# EasyEDA Pro project stm32带接收机（不想画了，但是有原理图）.epro

# Schematic Schematic2

## Sheets
1 P1: Board Name: Board2; Create Date: 2025-12-01; Page Name: P1; Project Name: 飞控; Schematic Name: Schematic2; Update Date: 2025-12-08; Company: 嘉立创EDA; Page Size: A4; Version: V1.0
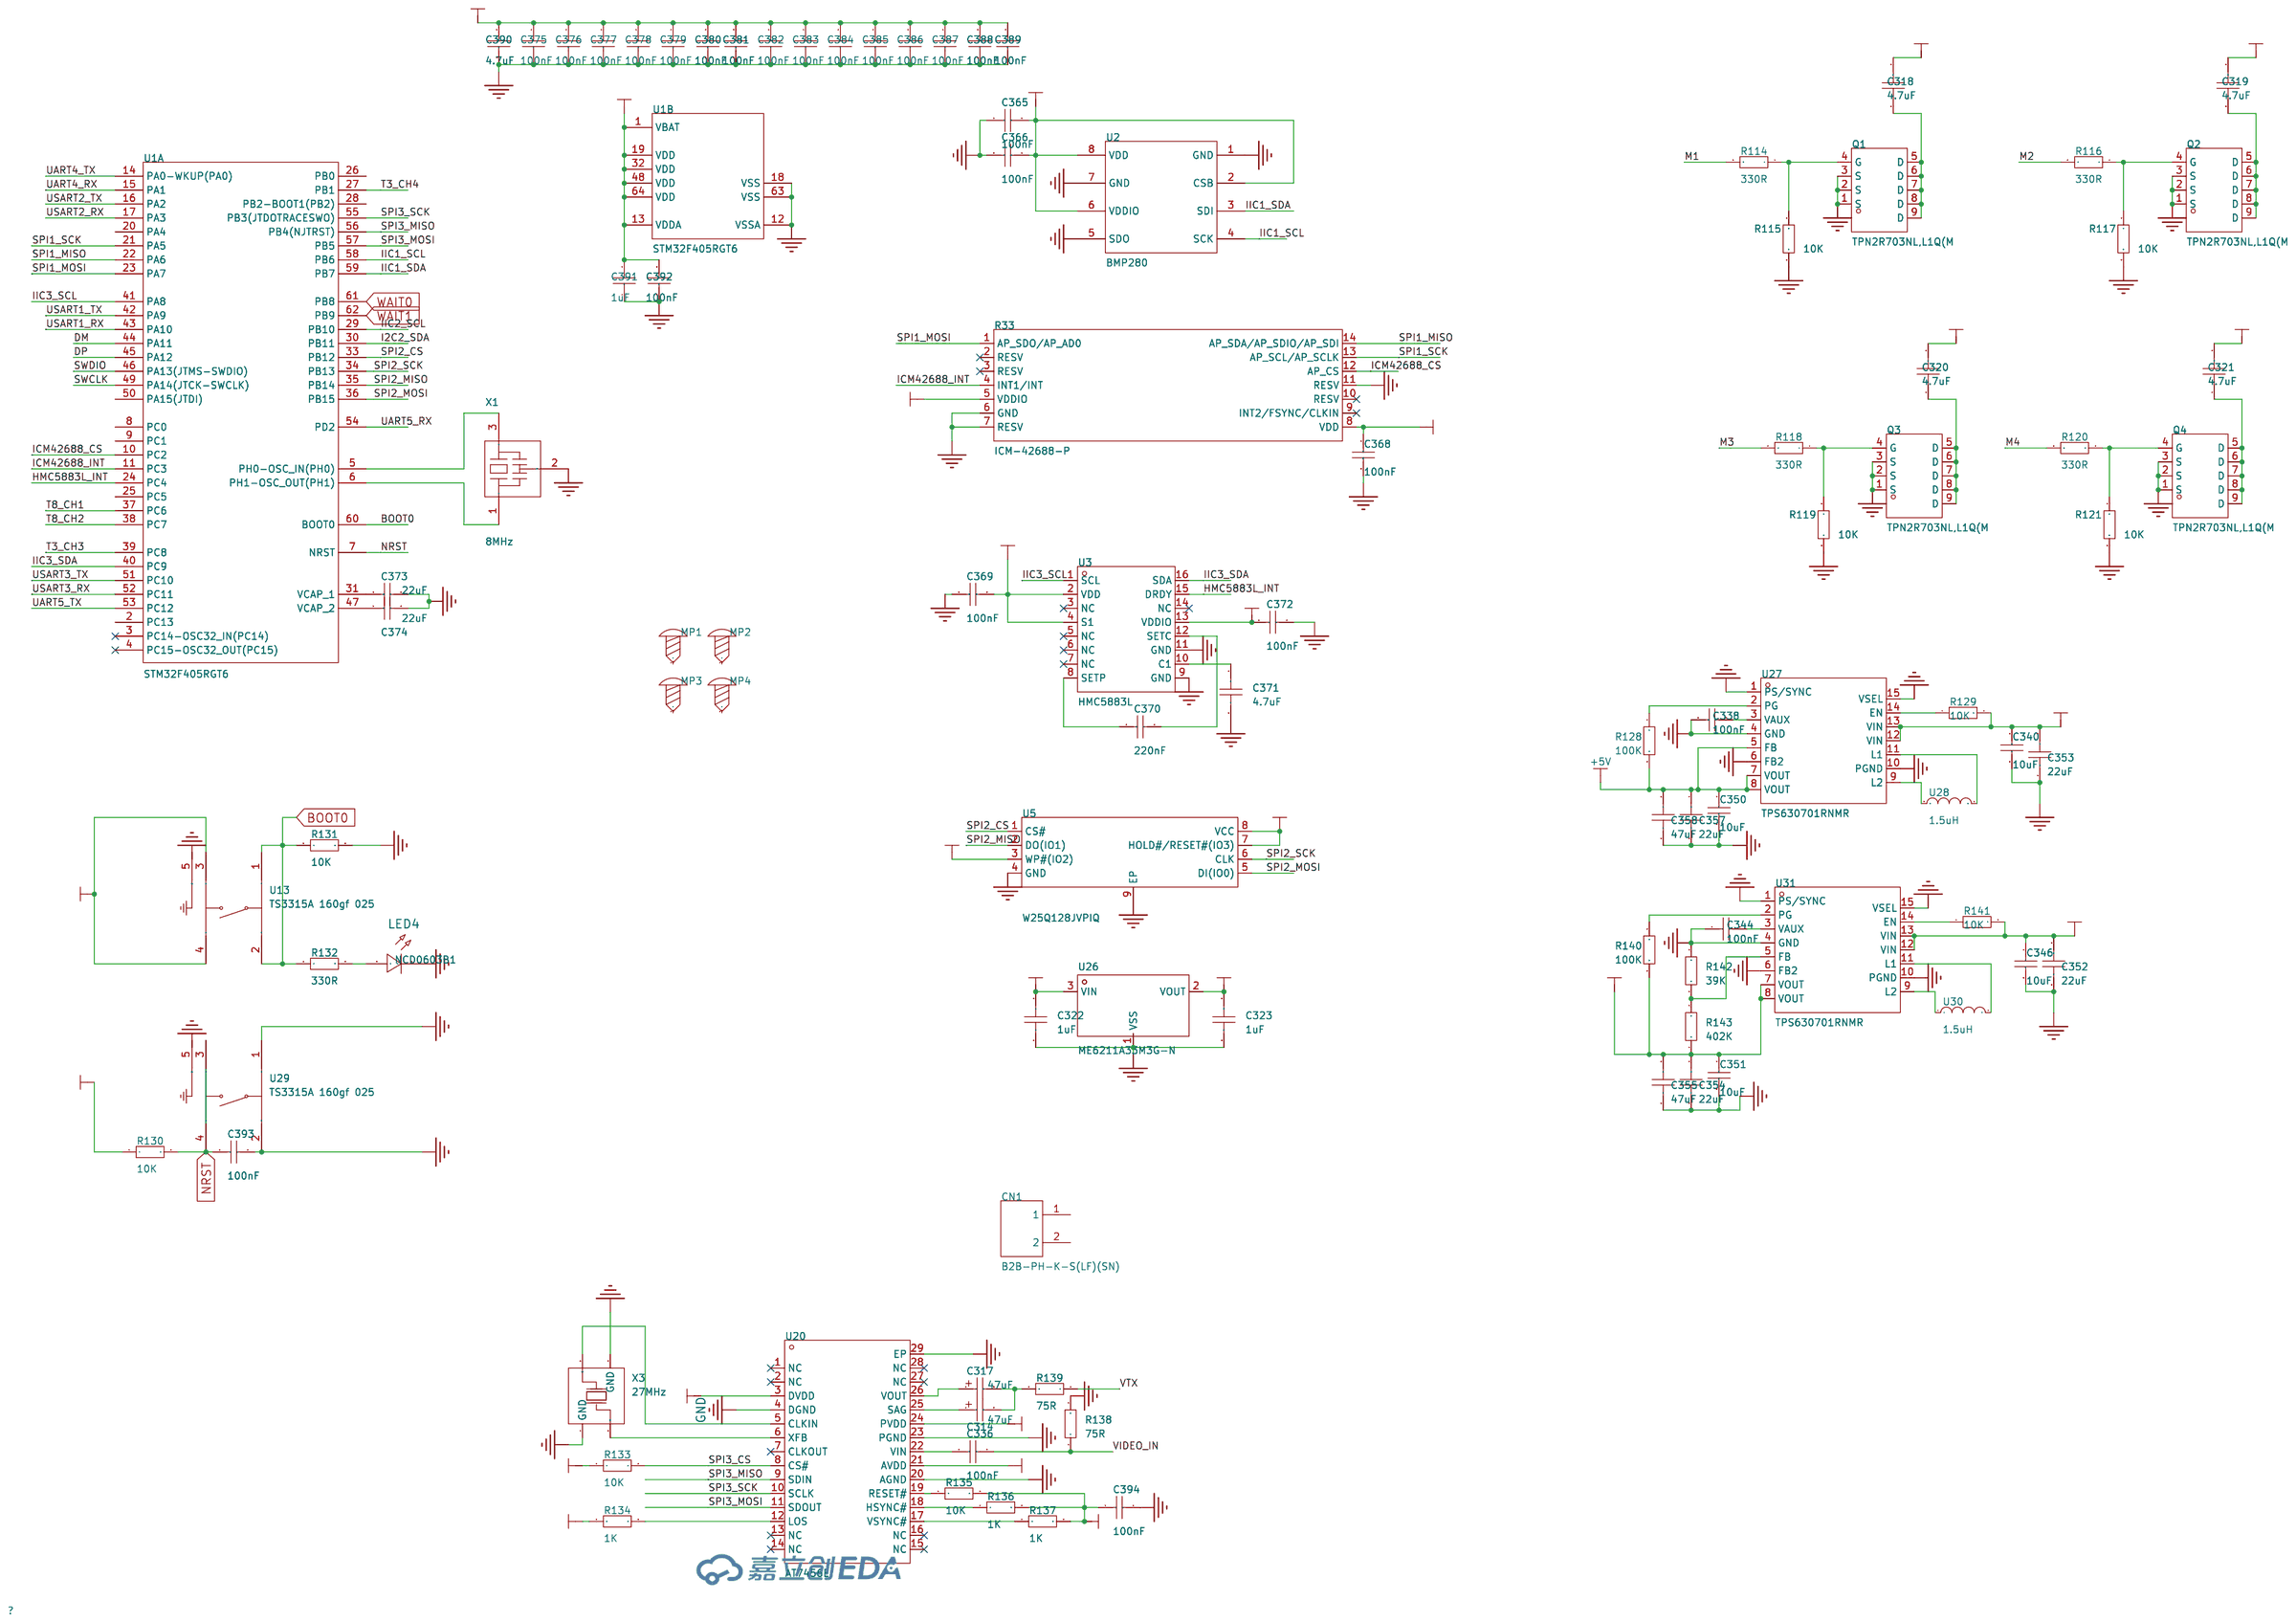
[diagram p0: P1]
2 P2: Create Date: 2025-12-08; Page Name: P2
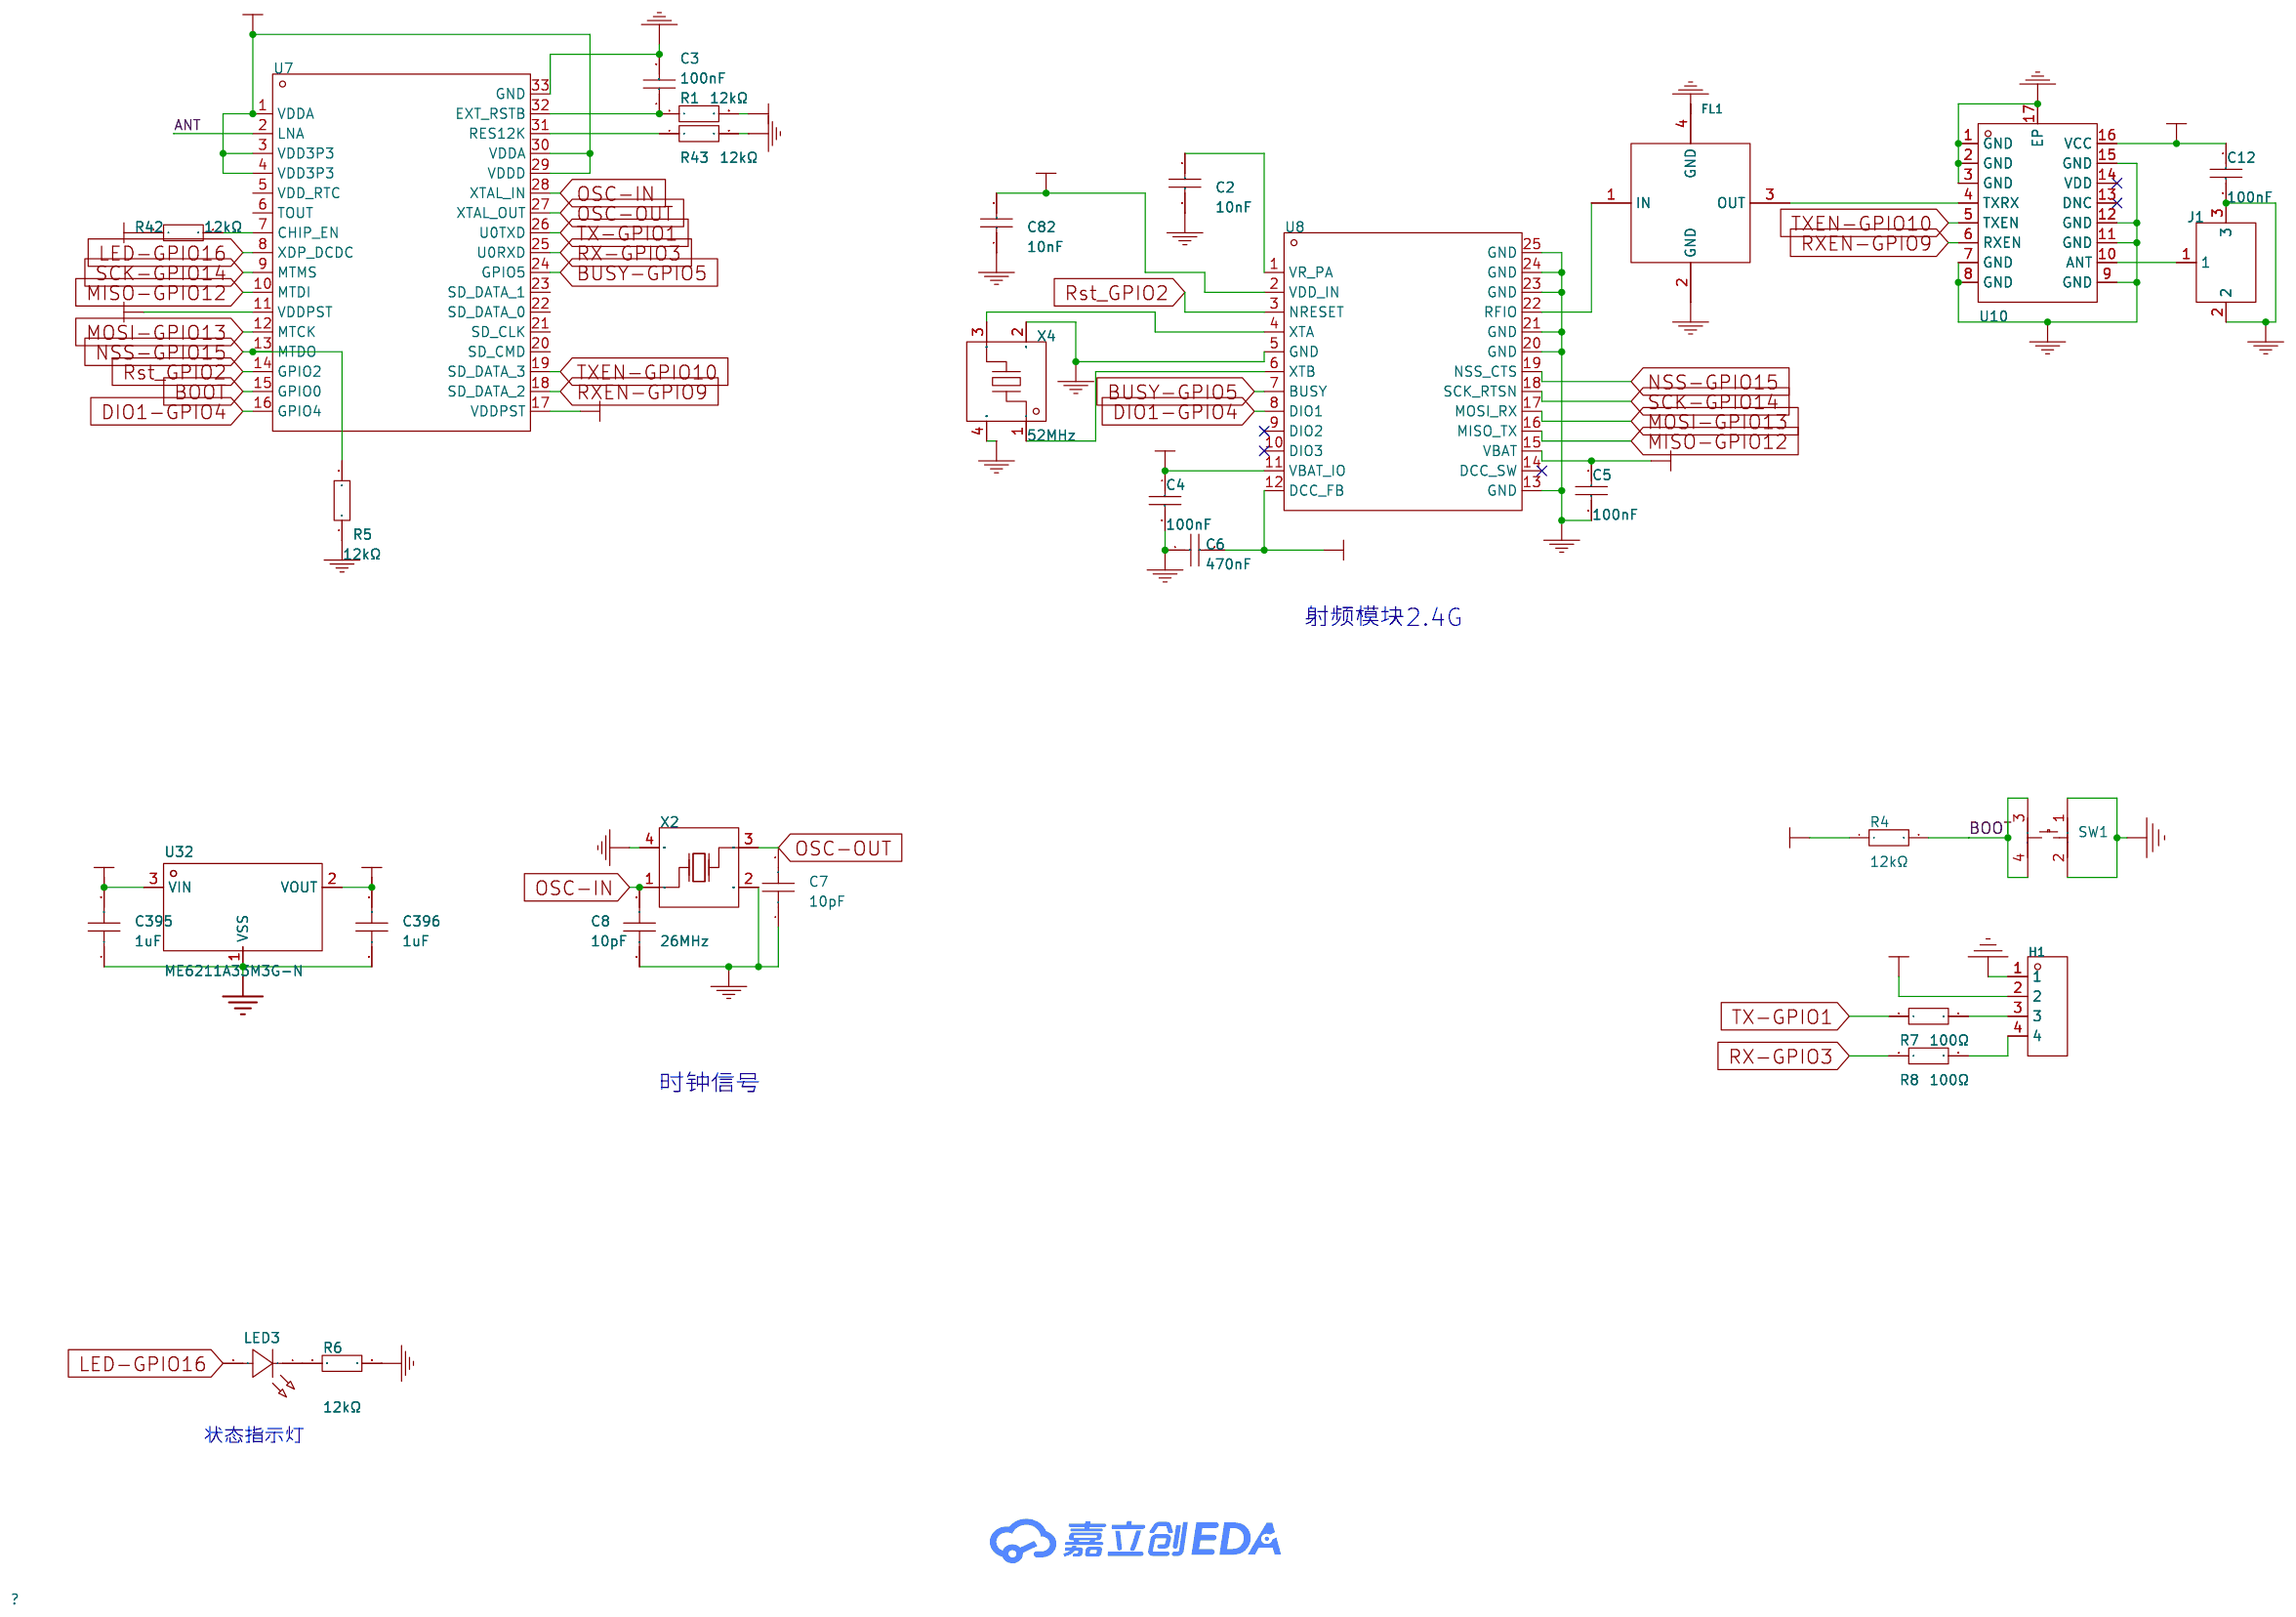
[diagram p1: P2]

## Parts
sheet P1
C314  47uF  [CAP-SMD_L3.2-W1.6-RD]
C317  47uF  [CAP-SMD_L3.2-W1.6-RD]
C318  4.7uF  [C0603]
C319  4.7uF  [C0603]
C320  4.7uF  [C0603]
C321  4.7uF  [C0603]
C322  1uF  [C0402]
C323  1uF  [C0402]
C336  100nF  [C0402]
C338  100nF  [C0402]
C340  10uF  [C0402]
C344  100nF  [C0402]
C346  10uF  [C0402]
C350  10uF  [C0402]
C351  10uF  [C0402]
C352  22uF  [C0805]
C353  22uF  [C0805]
C354  22uF  [C0805]
C355  47uF  [C0805]
C357  22uF  [C0805]
C358  47uF  [C0805]
C365  100nF  [C0402]
C366  100nF  [C0402]
C368  100nF  [C0402]
C369  100nF  [C0402]
C370  220nF  [C0402]
C371  4.7uF  [C0603]
C372  100nF  [C0402]
C373  22uF  [C0402]
C374  22uF  [C0402]
C375  100nF  [C0402]
C376  100nF  [C0402]
C377  100nF  [C0402]
C378  100nF  [C0402]
C379  100nF  [C0402]
C380  100nF  [C0402]
C381  100nF  [C0402]
C382  100nF  [C0402]
C383  100nF  [C0402]
C384  100nF  [C0402]
C385  100nF  [C0402]
C386  100nF  [C0402]
C387  100nF  [C0402]
C388  100nF  [C0402]
C389  100nF  [C0402]
C390  4.7uF  [C0402]
C391  1uF  [C0402]
C392  100nF  [C0402]
C393  100nF  [C0402]
C394  100nF  [C0402]
CN1  B2B-PH-K-S(LF)(SN)  [CONN-TH_B2B-PH-K-S]
LED4  NCD0603B1  [LED0603-RD]
MP1  M2螺丝  [M2螺丝]
MP2  M2螺丝  [M2螺丝]
MP3  M2螺丝  [M2螺丝]
MP4  M2螺丝  [M2螺丝]
Q1  TPN2R703NL,L1Q(M  [TSON-8_L3.1-W3.1-P0.65-LS3.3-BL-EP]
Q2  TPN2R703NL,L1Q(M  [TSON-8_L3.1-W3.1-P0.65-LS3.3-BL-EP]
Q3  TPN2R703NL,L1Q(M  [TSON-8_L3.1-W3.1-P0.65-LS3.3-BL-EP]
Q4  TPN2R703NL,L1Q(M  [TSON-8_L3.1-W3.1-P0.65-LS3.3-BL-EP]
R33  ICM-42688-P  [LGA-14_L3.0-W2.5-P0.50-TL]
R114  330R  [R0402]
R115  10K  [R0402]
R116  330R  [R0402]
R117  10K  [R0402]
R118  330R  [R0402]
R119  10K  [R0402]
R120  330R  [R0402]
R121  10K  [R0402]
R128  100K  [R0402]
R129  10K  [R0402]
R130  10K  [R0402]
R131  10K  [R0402]
R132  330R  [R0402]
R133  10K  [R0402]
R134  1K  [R0402]
R135  10K  [R0402]
R136  1K  [R0402]
R137  1K  [R0402]
R138  75R  [R0402]
R139  75R  [R0402]
R140  100K  [R0402]
R141  10K  [R0402]
R142  39K  [R0402]
R143  402K  [R0402]
U1  STM32F405RGT6  [LQFP-64_L10.0-W10.0-P0.50-LS12.0-BL]  (sections 1,2)
U2  BMP280  [LGA-8_L2.5-W2.0-P0.65_AMP6127]
U3  HMC5883L  [LPCC-16_L3.0-W3.0-P0.50-BL]
U5  W25Q128JVPIQ  [WSON-8_L5.0-W6.0-P1.27-BL-EP]
U13  TS3315A 160gf 025  [SW-SMD_4P-L3.4-W3.4-P2.00-LS4.0_TS3315A160GF]
U20  AT7456E  [TSSOP-28_L9.7-W4.4-P0.65-LS6.4-BL-EP-2]
U26  ME6211A33M3G-N  [SOT-23-3_L2.9-W1.6-P1.90-LS2.8-BR]
U27  TPS630701RNMR  [VQFN-HR-15_L3.0-W2.5-P0.50-BL_TPS63070RNMR]
U28  1.5uH  [IND-SMD_L2.5-W2.0_MEKK2520TR47M]
U29  TS3315A 160gf 025  [SW-SMD_4P-L3.4-W3.4-P2.00-LS4.0_TS3315A160GF]
U30  1.5uH  [IND-SMD_L2.5-W2.0_MEKK2520TR47M]
U31  TPS630701RNMR  [VQFN-HR-15_L3.0-W2.5-P0.50-BL_TPS63070RNMR]
X1  8MHz  [OSC-SMD_3P-L3.2-W1.3-P1.2-L]
X3  27MHz  [OSC-SMD_4P-L3.2-W2.5-BL]
sheet P2
C2  10nF  [C0402]
C3  100nF  [C0402]
C4  100nF  [C0402]
C5  100nF  [C0402]
C6  470nF  [C0402]
C7  10pF  [C0402]
C8  10pF  [C0402]
C12  100nF  [C0402]
C82  10nF  [C0402]
C395  1uF  [C0402]
C396  1uF  [C0402]
FL1  2450FM07D0034T  [FILTER-SMD_4P-L1.0-W0.5-L]
H1  PZ254V-11-04P  [HDR-TH_4P-P2.54-V-M]
J1  BWU.FL-IPEX1  [IPEX-SMD_BWIPX-1-001E]
LED3  XL-1005UGC  [0402]
R1  12kΩ  [0402]
R4  12kΩ  [0402]
R5  12kΩ  [0402]
R6  12kΩ  [0402]
R7  100Ω  [0402]
R8  100Ω  [0402]
R42  12kΩ  [0402]
R43  12kΩ  [0402]
SW1  TS-1928-B  [KEY-SMD_4P-L2.8-W2.0-P1.20-LS3.0-TL]
U7  ESP8285H16  [QFN-32_L5.0-W5.0-P0.50-TL-EP3.7]
U8  SX1280IMLTRT  [QFN-24_L4.0-W4.0-P0.50-BL-EP2.6]
U10  AT2401C  [QFN-16_L3.0-W3.0-P0.50-BL-EP1.7]
U32  ME6211A33M3G-N  [SOT-23-3_L2.9-W1.6-P1.90-LS2.8-BR]
X2  26MHz  [CRYSTAL-SMD_4P-L2.0-W1.6-BL]
X4  52MHz  [CRYSTAL-SMD_4P-L2.0-W1.6-BL]

## Library data of the parts
C314 C317 = TC212A476K006Y: 容值:47uF;精度:±10%;额定电压:6.3V;等效串联电阻:2.5Ω@100kHz;; LCSC Part Name: 47uF ±10% 6.3V; Supplier Part: C108525; Manufacturer: Sunlord(顺络); Supplier Footprint: CASE-A-3216-18(mm); JLCPCB Part Class: Extended Part; Datasheet: https://atta.szlcsc.com/upload/public/pdf/source/20231030/DDA5D10C6B7FCAF98AC7C23C2BD0B0CB.pdf; Supplier: LCSC; Tolerance: ±10%; Rated Voltage: 6.3V; Equivalent Series Resistance(ESR): 2.5Ω@100kHz; Operating Temperature: -55℃~+125℃; Voltage Rated: 6.3V; Temperature Coefficient: X5R
C318-C321 C371 = CAP_0603: Supplier Footprint: 0603
C7 C8 C322 C323 C395 C396 = CL05C100JB5NNNC: 容值:10pF;精度:±5%;额定电压:50V;材质(温度系数):C0G;; LCSC Part Name: 10pF ±5% 50V; Supplier Part: C32949; Manufacturer: SAMSUNG(三星); Supplier Footprint: 0402; JLCPCB Part Class: 基础库; Datasheet: https://atta.szlcsc.com/upload/public/pdf/source/20160103/1457707722238.pdf; Supplier: LCSC; Tolerance: ±5%; Voltage Rated: 50V; Temperature Coefficient: C0G
C3-C5 C12 C336 C338 C340 C344 C346 C350 C351 C365 C366 C368-C370 C372-C394 = CL05B104KO5NNNC: 容值:100nF;精度:±10%;额定电压:16V;材质(温度系数):X7R;; LCSC Part Name: 100nF ±10% 16V; Supplier Part: C1525; Manufacturer: SAMSUNG(三星); Supplier Footprint: 0402; JLCPCB Part Class: 基础库; Datasheet: https://atta.szlcsc.com/upload/public/pdf/source/20160103/1457707674891.pdf; Supplier: LCSC; Tolerance: ±10%; Voltage Rated: 16V; Temperature Coefficient: X7R
C352-C355 C357 C358 = CAP_0805: Supplier Footprint: 0805
CN1 = B2B-PH-K-S(LF)(SN): 插针结构:1x2P;间距:2mm;安装方式:直插;参考系列:PH;总PIN数:2P;排数:1;每排PIN数:2;行距:-;额定电流:2A;触头材质:黄铜;触头镀层:锡;工作温度:-25℃~+85℃;; LCSC Part Name: 1x2P 间距:2mm 直插 系列:PH; Supplier Part: C131337; Manufacturer: JST; Supplier Footprint: 插件,P=2mm; JLCPCB Part Class: 扩展库; Datasheet: https://item.szlcsc.com/datasheet/B2B-PH-K-S(LF)(SN)/142630.html; Supplier: LCSC; Pins Structure: 1x2P; Pitch: 2mm; Mounting Type: 直插; Reference Series: PH; Number of Pins: 2P; Number of Rows: 1; Number of PINs Per Row: 2; Current Rating: 2A; Contact Material: 黄铜; Contact Plating: 锡; Operating Temperature: -25℃~+85℃; Voltage Rating: 100V; Plastic Material: PA66; Flame Retardant Rating: UL94V-0; Supplementary Features: 打K脚; Color: 白色; Z-Height of the Board: 6mm; X-Length of Bottom Edge on Board (Spacing Line): 5.9mm; Y-Width of Bottom Edge on Board: 4.5mm
LED4 = NCD0603B1: 发光颜色:蓝色;功率:72mW;透镜颜色:无色透明;主波长:463nm~475nm;发光强度:80mcd~220mcd;发光角度:130°;工作温度:-30℃~+85℃;; LCSC Part Name: 蓝灯 0603蓝灯   正贴; Supplier Part: C84266; Manufacturer: 国星光电; Supplier Footprint: 0603; JLCPCB Part Class: Extended Part; Datasheet: https://atta.szlcsc.com/upload/public/pdf/source/20200820/C84266_6A3CDBEFA72C6CAD68EDA53474ADAE6C.pdf; Supplier: LCSC; Emitted Color: 蓝色; Forward Voltage (VF): 2.6V~3.6V; Forward Current: 10mA; Power Dissipation: 72mW; Lens Color: 无色透明; Dominant Wavelength: 463nm~475nm; Luminous Intensity: 80mcd~220mcd; Viewing Angle: 130°; Operating Temperature: -30℃~+85℃
MP1-MP4 = 螺丝孔
Q1-Q4 = TPN2R703NL,L1Q(M: 类型:1个N沟道;漏源电压(Vdss):30V;连续漏极电流(Id):-;导通电阻(RDS(on)@Vgs,Id):3.3mΩ@4.5V,22.5A;功率:42W;阈值电压(Vgs(th)@Id):1.3V@0.3mA;; Supplier Part: C5307666; Manufacturer: TOSHIBA(东芝); Supplier Footprint: TSON-8; JLCPCB Part Class: 扩展库; Datasheet: https://atta.szlcsc.com/upload/public/pdf/source/20221207/F3F28B90115C5E074AC0CD2ED28456D7.pdf; Supplier: LCSC; Type: 1个N沟道; Drain Source Voltage (Vdss): 30V; Drain Source On Resistance (RDS(on)@Vgs,Id): 3.3mΩ@4.5V,22.5A; Power Dissipation (Pd): 42W; Gate Threshold Voltage (Vgs(th)@Id): 1.3V@0.3mA; Input Capacitance (Ciss@Vds): 1.6nF@15V; Reverse Transfer Capacitance (Crss@Vds): 53pF@15V
R33 = ICM-42688-P: LCSC Part Name: ICM 42688 P; Supplier Part: C1850418; Manufacturer: TDK InvenSense(应美盛); Supplier Footprint: LGA-14(2.5x3); JLCPCB Part Class: 扩展库; Datasheet: https://atta.szlcsc.com/upload/public/pdf/source/20210703/CF24204867ACE5B754A2B035F23E5931.pdf; Supplier: LCSC
R114-R121 R128-R143 = Res_0402: Supplier Footprint: 0402
U1 = STM32F405RGT6: CPU内核:ARM-M4;CPU最大主频:168MHz;应用领域:-;; LCSC Part Name: 带DSP和FPU的高性能基础系列ARM Cortex-M4 MCU，具有1 MB Flash、168 MHz CPU和ART加速器; Supplier Part: C15742; Manufacturer: ST(意法半导体); Supplier Footprint: LQFP-64(10x10); JLCPCB Part Class: 扩展库; Datasheet: https://item.szlcsc.com/datasheet/STM32F405RGT6/16424.html; Supplier: LCSC; CPU Core: ARM-M4; CPU Maximum Speed: 168MHz; Program Storage Size: 1MB; Program Memory Type: FLASH; Number of I/O: 51; ADC (Bit): 12bit; DAC (Bit): 12bit; Voltage - Supply: 1.8V~3.6V
U2 = BMP280: Bosch气压传感器新品，可测量大气压力，带高精度温度测量，可校准精确计算海拔高度。I2C或SPI接口，宽量程（300-1100hpa），精度高; LCSC Part Name: BMP280 停产; Supplier Part: C83291; Manufacturer: Bosch(博世); Supplier Footprint: LGA-8(2x2.5); JLCPCB Part Class: 扩展库; Datasheet: https://atta.szlcsc.com/upload/public/pdf/source/20200702/C83291_F39E84AB7DFC569A4C7554F8659640A1.pdf; Supplier: LCSC
U3 = HMC5883L: Supplier Part: C2859540; Supplier Footprint: LPCC-16(3x3); JLCPCB Part Class: 扩展库; Supplier: LCSC
U5 = W25Q128JVPIQ: 接口类型:SPI;存储容量:128Mbit;时钟频率(fc):133MHz;; LCSC Part Name: 支持双路/四路SPI接口的3V、128Mbit 串行闪存; Supplier Part: C2803379; Manufacturer: Winbond(华邦); Supplier Footprint: WSON-8-EP(5x6); JLCPCB Part Class: 扩展库; Datasheet: https://item.szlcsc.com/datasheet/W25Q128JVPIQ/2946213.html; Supplier: LCSC; Interface: SPI; Memory Size: 128Mbit; Clock Frequency: 133MHz; Voltage - Supply: 2.7V~3.6V; Program / Erase Cycles: 100000次; Page Programming Time (Tpp): 400us; Block Erase Time(tBE): 120ms@(32KB); Data Retention - TDR (Year): 20年; Operating Temperature: -40℃~+85℃
U13 U29 = TS3315A 160gf 025: 触点电流：50mA 额定电压(DC)：12V 电路结构：单刀单掷 安装方式：立贴 按钮形状：圆形按钮 作用力：160gf±30gf 机械寿命：100000 工作温度：-30℃~+80℃ 开关长度：3.3mm 开关宽度：3.3mm 开关高度：1.5mm; LCSC Part Name: 3*3*1.5mm 四脚贴片 160gf不锈钢; Supplier Part: C5373425; Manufacturer: SHOU HAN(首韩); Supplier Footprint: SMD; Datasheet: https://atta.szlcsc.com/upload/public/pdf/source/20230321/D88CDF2C2FC55C1F5AF306EDD5E838E4.pdf; Supplier: LCSC
U20 = AT7456E: 视频字符叠加芯片，跟MAX7456-pin-pin; Supplier Part: C82351; Manufacturer: 杭州中科微; Supplier Footprint: TSSOP-28; JLCPCB Part Class: Extended Part; Datasheet: https://atta.szlcsc.com/upload/public/pdf/source/20180326/C82351_A40539A53E8345C88178541014FDE5FB.pdf; Supplier: LCSC
U26 U32 = ME6211A33M3G-N: 输出类型:固定;工作电压:6V;输出电压:3.3V;输出电流:500mA;电源纹波抑制比(PSRR):70dB@(1kHz);输出极性:正极;; LCSC Part Name: 输入6V 输出3.3V 500mA; Supplier Part: C168807; Manufacturer: MICRONE(南京微盟); Supplier Footprint: SOT-23-3; JLCPCB Part Class: 扩展库; Datasheet: https://atta.szlcsc.com/upload/public/pdf/source/20180224/C168807_15194366627921363679.pdf; Supplier: LCSC; Output Type: 固定; Voltage - Supply: 6V; Output Voltage: 3.3V; Output Current: 500mA; Power Supply Rejection Ratio (PSRR): 70dB@(1kHz); Voltage Dropout: 120mV@(100mA); standby current: 60uA; Noise: 50uVrms; Features: 过流保护；带使能；短路保护; Operating Temperature: -40℃~+150℃; Output Configuration: 正极; Number of Outputs: 1
U27 U31 = TPS630701RNMR: 功能类型:升降压型;工作电压:2V~16V;输出电压:5V;输出电流:2A;输出类型:固定;; LCSC Part Name: 2V 至 16V 3.6A 降压-升压转换器; Supplier Part: C2876599; Manufacturer: TI(德州仪器); Supplier Footprint: VQFN-15-HR(2.5x3); JLCPCB Part Class: 扩展库; Datasheet: https://www.ti.com/cn/lit/gpn/tps63070; Supplier: LCSC; Function: 升降压型; Voltage - Supply: 2V~16V; Output Voltage: 5V; Output Current: 2A; Frequency - Switching: 2.4MHz; Operating Temperature: -40℃~+125℃@(TJ); Synchronous Rectifier: 是; Number of Outputs: 1; Topology: 降压-升压式; Quiescent Current: 50uA; Switch tube (built-in/external): 内置; Output Type: 固定
U28 U30 = FTC252012S1R5MBCA: 电感值:1.5uH;精度:±20%;额定电流:3.7A;饱和电流(Isat):4.5A;类型:-;; LCSC Part Name: 1.5uH ±20% 4.5A; Supplier Part: C5832371; Manufacturer: cjiang(长江微电); Supplier Footprint: 1008; JLCPCB Part Class: 扩展库; Datasheet: https://item.szlcsc.com/datasheet/FTC252012S1R5MBCA/6763491.html; Supplier: LCSC; Tolerance: ±20%; Current Rating: 3.7A; Current - Saturation(Isat): 4.5A; DC Resistance(DCR): 44mΩ
X1 = CSTCE8M00G55-R0: 频率:8MHz;频率容差:±0.5%;内置负载电容:33pF;谐振阻抗:-;; LCSC Part Name: 8M ±0.5% 33pF 停产; Supplier Part: C70457; Manufacturer: muRata(村田); Supplier Footprint: SMD3213-3P; JLCPCB Part Class: 扩展库; Datasheet: https://atta.szlcsc.com/upload/public/pdf/source/20160405/1459820110299.pdf; Supplier: LCSC; Frequency Stability: ±0.2%; Frequency Tolerance: ±0.5%; Built-in Load Capacitance: 33pF; Operating Temperature: -20℃~+80℃
X3 = X1E000021015800: 频率:27MHz;晶振类型:贴片无源晶振;负载电容:10pF;等效串联电阻(ESR):40Ω;频率公差:±10ppm;频率稳定度:-;工作温度:-40℃~+85℃;; LCSC Part Name: TSX-3225 27MHz 10pF 10ppm; Supplier Part: C91748; Manufacturer: EPSON(爱普生); Supplier Footprint: SMD3225-4P; JLCPCB Part Class: Extended Part; Datasheet: https://atta.szlcsc.com/upload/public/pdf/source/20170103/1483439947812.pdf; Supplier: LCSC; Operating Temperature: -40℃~+85℃; Crystal Type: 贴片无源晶振; Load Capacitance: 10pF; Equivalent Series Resistance (ESR): 40Ω; Frequency Tolerance: ±10ppm
C2 C82 = CL05B103KB5NNNC: 容值:10nF;精度:±10%;额定电压:50V;材质(温度系数):X7R;; LCSC Part Name: 10nF ±10% 50V; Supplier Part: C15195; Manufacturer: SAMSUNG(三星); Supplier Footprint: 0402; JLCPCB Part Class: Basic Part; Datasheet: https://atta.szlcsc.com/upload/public/pdf/source/20160103/1457707674468.pdf; Supplier: LCSC; Tolerance: ±10%; Voltage Rated: 50V; Temperature Coefficient: X7R
C6 = CL05A474KP5NNNC: 容值:470nF;精度:±10%;额定电压:10V;材质(温度系数):X5R;; LCSC Part Name: 470nF ±10% 10V; Supplier Part: C47339; Manufacturer: SAMSUNG(三星); Supplier Footprint: 0402; JLCPCB Part Class: 基础库; Datasheet: https://atta.szlcsc.com/upload/public/pdf/source/20160103/1457707728896.pdf; Supplier: LCSC; Tolerance: ±10%; Voltage Rated: 10V; Temperature Coefficient: X5R
FL1 = 2450FM07D0034T: 带宽:100MHz;插入损耗:0.75dB;; Supplier Part: C2651081; Manufacturer: JOHANSON(约翰逊); Supplier Footprint: SMD-4P,0.5x1mm; JLCPCB Part Class: 扩展库; Datasheet: https://atta.szlcsc.com/upload/public/pdf/source/20210612/9CA01AE84E996BD7C4301146C7410C29.pdf; Supplier: LCSC; Bandwidth: 100MHz; Insertion Loss: 0.75dB
H1 = PZ254V-11-04P: 排数:单排;总PIN位数:4P;间距:2.54mm;插针结构:1x4P;行距:-;安装类型:直插;圆针/方针:方针;额定电流:3A;额定电压:250V;配合针长度:6mm;塑高:2.5mm;端接针长度:3mm;触头材质:-;工作温度范围:-40℃~+105℃;颜色:黑色;; LCSC Part Name: 2.54mm 1x4P 直插 方针; Supplier Part: C2691448; Manufacturer: XFCN(兴飞); Supplier Footprint: 插件,P=2.54mm; JLCPCB Part Class: 扩展库; Datasheet: https://atta.szlcsc.com/upload/public/pdf/source/20200309/C492403_F9F19131791D08044AD4F84F8E751A34.pdf; Supplier: LCSC; Number of Rows: 单排; Number of Pins: 4P; Pitch: 2.54mm; Pin Structure: 1x4P; Mounting Type: 直插; Circluar Pins/Square Pins: 方针; Current Rating (Max): 3A; Voltage Rating (Max): 250V; Length of Mating Pin: 6mm; Insulation Height: 2.5mm; Length of End Connection Pin: 3mm; Operating Temperature Range: -40℃~+105℃; Color: 黑色
J1 = BWU.FL-IPEX1: 连接器类型:板端;接口类型:内针;频率-最大值:6GHz;接口直径:2mm;射频系列:IPEX;端口数量:1;阻抗:50Ω;接口长度/高度:1.25mm;工作温度范围:260℃;; LCSC Part Name: IPEX 内针; Supplier Part: C5137195; Manufacturer: BAT WIRELESS(蝙蝠无线); Supplier Footprint: SMD; JLCPCB Part Class: 扩展库; Datasheet: https://atta.szlcsc.com/upload/public/pdf/source/20220815/058ABE525AAE400925F1A3839AB872AC.pdf; Supplier: LCSC; Connector Type: 板端; Interface Type: 内针; Frequency-Max: 6GHz; Interface Diameter: 2mm; RF Series: IPEX; Number of Ports: 1; Impedance: 50Ω; Interface Length/Height: 1.25mm; Operating Temperature Range: 260℃
LED3 = XL-1005UGC: 发光颜色:翠绿;主波长:516nm;色温:-;功率:80mW;安装方式:正贴;; LCSC Part Name: 正贴; Supplier Part: C2856703; Manufacturer: XINGLIGHT(成兴光); JLCPCB Part Class: 扩展库; Datasheet: https://atta.szlcsc.com/upload/public/pdf/source/20221102/FF8D6BC2225363A60A01D46BB802F217.pdf; Supplier: LCSC; Emitted Color: 翠绿; Lens Color: 无色透明; Dominant Wavelength: 516nm; Peak Wavelength: 531nm; Forward Current: 25mA; Power Dissipation: 80mW; Viewing Angle: 120°; Mounting Sytle: 正贴; Operating Temperature: -30℃~+85℃
R1 R4-R6 R42 R43 = 0402WGF1202TCE: 电阻类型:厚膜电阻;阻值:12kΩ;精度:±1%;功率:62.5mW;; LCSC Part Name: 12kΩ ±1% 62.5mW; Supplier Part: C25752; Manufacturer: UNI-ROYAL(厚声); JLCPCB Part Class: 基础库; Datasheet: https://atta.szlcsc.com/upload/public/pdf/source/20200306/C422600_1E6D84923E4A46A82E41ADD87F860B5C.pdf; Supplier: LCSC; Type: 厚膜电阻; Tolerance: ±1%; Power(Watts): 62.5mW; Temperature Coefficient: ±100ppm/℃; Overload Voltage (Max): 50V; Operating Temperature Range: -55℃~+155℃
R7 R8 = 0402WGF1000TCE: 阻值:100Ω;精度:±1%;功率:62.5mW;温度系数:±200ppm/℃;电阻类型:厚膜电阻;; LCSC Part Name: 100Ω ±1% 62.5mW 厚膜电阻; Supplier Part: C25076; Manufacturer: UNI-ROYAL(厚声); JLCPCB Part Class: 基础库; Datasheet: https://atta.szlcsc.com/upload/public/pdf/source/20200306/C422600_1E6D84923E4A46A82E41ADD87F860B5C.pdf; Supplier: LCSC; Tolerance: ±1%; Power(Watts): 62.5mW; Overload Voltage (Max): 50V; Temperature Coefficient: ±200ppm/℃; Type: 厚膜电阻; Operating Temperature Range: -55℃~+155℃
SW1 = TS-1928-B: 触点电流:50mA;额定电压(DC):12V;绝缘电阻:-;电路结构:单刀单掷;安装方式:立贴;带灯:无;作用力:160gf;机械寿命:30万次;带支架:否;; LCSC Part Name: 立贴 1.95*2.8*0.6mm 轻触开关; Supplier Part: C1121891; Manufacturer: XKB Connectivity(中国星坤); Supplier Footprint: SMD; JLCPCB Part Class: 扩展库; Datasheet: https://atta.szlcsc.com/upload/public/pdf/source/20211011/D4E0D57631292A8298BD84F341C06C74.pdf; Supplier: LCSC; Contact Current: 50mA; Voltage Rating (DC): 12V; Circuit: 单刀单掷; Mounting Style: 立贴; Actuator Style: 圆形按钮; Actuator/Cap Color: 黑色; With Lamp: 无; Operating Force: 160gf; Mechanical Life: 30万次; Operating Temperature: -30℃~+85℃; Switch Length: 1.95mm; Switch Width: 2.8mm; Switch Height: 0.6mm; Strike Gundam: 否
U7 = ESP8285H16: 接口类型:-;; Supplier Part: C967019; Manufacturer: ESPRESSIF(乐鑫); Supplier Footprint: QFN-32; JLCPCB Part Class: 扩展库; Datasheet: https://atta.szlcsc.com/upload/public/pdf/source/20201208/C967018_16BE38E2B139B5CC4A4A2601BD6D347C.pdf; Supplier: LCSC
U8 = SX1280IMLTRT: Supplier Part: C125969; Manufacturer: SEMTECH; Supplier Footprint: QFN-24-EP(4x4); JLCPCB Part Class: 扩展库; Datasheet: https://atta.szlcsc.com/upload/public/pdf/source/20180620/C125969_B671A7544015FF474F30CCF0F8154652.PDF; Supplier: LCSC
U10 = AT2401C: Supplier Part: C783588; Manufacturer: 杭州中科微; Supplier Footprint: QFN; JLCPCB Part Class: 扩展库; Datasheet: https://atta.szlcsc.com/upload/public/pdf/source/20210918/B63766BE646BC5750E173F3CF585A1F8.pdf; Supplier: LCSC
X2 = S2126000121080: 频率:26MHz;频率公差:±10ppm;负载电容:12pF;; LCSC Part Name: 26MHz ±10ppm 内置负载电容:12pF; Supplier Part: C390789; Manufacturer: JGHC(晶光华); Supplier Footprint: SMD2016-4P; JLCPCB Part Class: 扩展库; Datasheet: https://atta.szlcsc.com/upload/public/pdf/source/20191012/C390789_EEB0CA5BA4936358B143D734CA2B8FF9.pdf; Supplier: LCSC; Crystal Type: 贴片无源晶振; Frequency Tolerance: ±10ppm; Load Capacitance: 12pF; Equivalent Series Resistance (ESR): 80Ω; Operating Temperature: -40℃~+85℃
X4 = 7D052000K01: 频率:52MHz;频率公差:±10ppm;负载电容:11pF;; LCSC Part Name: 52MHz ±10ppm 11pF; Supplier Part: C781784; Manufacturer: HD(浩都频率); Supplier Footprint: SMD2016-4P; JLCPCB Part Class: 扩展库; Datasheet: https://atta.szlcsc.com/upload/public/pdf/source/20220223/F1A4CFB1E963BF2DCD368CB38C2B78AF.pdf; Supplier: LCSC; Crystal Type: 贴片无源晶振; Frequency Tolerance: ±10ppm; Frequency Stability: ±20ppm; Load Capacitance: 11pF

## Nets
3.3V: C4.1 C5.1 C12.1 C323.2 C396.2 R1.2 R4.1 R42.1 U7.1(VDDA) U7.3(VDD3P3) U7.4(VDD3P3) U7.11(VDDPST) U7.17(VDDPST) U7.29(VDDD) U7.30(VDDA) U8.11(VBAT_IO) U8.15(VBAT) U10.16(VCC) U26.2(VOUT) U32.2(VOUT)
3V3: C369.2 C372.1 C375.2 C376.2 C377.2 C378.2 C379.2 C380.2 C381.2 C382.2 C383.2 C384.2 C385.2 C386.2 C387.2 C388.2 C389.2 C390.2 C391.2 C392.2 U1.1(VBAT) U1.13(VDDA) U1.19(VDD) U1.32(VDD) U1.48(VDD) U1.64(VDD) U3.2(VDD) U3.4(S1) U3.13(VDDIO) U5.3(WP#(IO2)) U5.7(HOLD#/RESET#(IO3)) U5.8(VCC)
5V-IN: H1.2
+3.3V: C365.2 C366.2 C394.1 R133.1 R134.1 R135.2 R136.2 R137.2 U2.2(CSB) U2.6(VDDIO) U2.8(VDD) U20.3(DVDD) U20.21(AVDD) U20.24(PVDD)
+3.3V_MCU: C368.1 R33.5(VDDIO) R33.8(VDD) R130.1 U13.3(C) U13.4(D)
+5V: C322.2 C350.1 C357.2 C358.2 C395.2 R128.2 U26.3(VIN) U27.5(FB) U27.7(VOUT) U27.8(VOUT) U32.3(VIN)
+9V: C351.1 C354.2 C355.2 R140.2 R143.1 U31.7(VOUT) U31.8(VOUT)
+VBAT: C340.1 C346.1 C352.2 C353.2 R129.2 R141.2 U27.12(VIN) U27.13(VIN) U31.12(VIN) U31.13(VIN)
GND: C2.1 C3.2 C4.2 C5.2 C6.1 C7.1 C8.1 C12.2 C82.1 C322.1 C323.1 C338.1 C340.2 C344.1 C346.2 C350.2 C351.2 C352.1 C353.1 C354.1 C355.1 C357.1 C358.1 C365.1 C366.1 C368.2 C369.1 C371.2 C372.2 C373.2 C374.2 C375.1 C376.1 C377.1 C378.1 C379.1 C380.1 C381.1 C382.1 C383.1 C384.1 C385.1 C386.1 C387.1 C388.1 C389.1 C390.1 C391.1 C392.1 C393.1 C394.2 C395.1 C396.1 FL1.2(GND) FL1.4(GND) H1.1 J1.2 J1.3 LED4.1(C) Q1.1(S) Q1.2(S) Q1.3(S) Q2.1(S) Q2.2(S) Q2.3(S) Q3.1(S) Q3.2(S) Q3.3(S) Q4.1(S) Q4.2(S) Q4.3(S) R5.1 R6.2 R33.6(GND) R33.7(RESV) R33.11(RESV) R43.2 R115.2 R117.2 R119.2 R121.2 R131.2 R138.2 R142.2 SW1.1 SW1.2 U1.12(VSSA) U1.18(VSS) U1.63(VSS) U2.1(GND) U2.5(SDO) U2.7(GND) U3.9(GND) U3.11(GND) U5.4(GND) U5.9(EP) U7.33(GND) U8.5(GND) U8.13(GND) U8.20(GND) U8.21(GND) U8.23(GND) U8.24(GND) U8.25(GND) U10.1(GND) U10.2(GND) U10.3(GND) U10.7(GND) U10.8(GND) U10.9(GND) U10.11(GND) U10.12(GND) U10.15(GND) U10.17(EP) U13.5(GND) U20.4(DGND) U20.20(AGND) U20.23(PGND) U20.29(EP) U26.1(VSS) U27.1(PS/SYNC) U27.4(GND) U27.6(FB2) U27.10(PGND) U27.15(VSEL) U29.1(A) U29.2(B) U29.5(GND) U31.1(PS/SYNC) U31.4(GND) U31.6(FB2) U31.10(PGND) U31.15(VSEL) U32.1(VSS) X1.2(VSS) X2.2(GND) X2.4(GND) X3.2(GND) X3.4(GND) X4.2(GND) X4.4(GND)
VBAT: C318.2 C319.2 C320.2 C321.2
ANT: U7.2(LNA)
BOOT: R4.2 SW1.3 SW1.4 U7.15(GPIO0)
BOOT0: R131.1 R132.1 U1.60(BOOT0) U13.1(A) U13.2(B)
BUSY-GPIO5: U7.24(GPIO5) U8.7(BUSY)
DCC_FB: C6.2 C82.2 U8.2(VDD_IN) U8.12(DCC_FB)
DIO1-GPIO4: U7.16(GPIO4) U8.8(DIO1)
DM: U1.44(PA11)
DP: U1.45(PA12)
HMC5883L_INT: U1.24(PC4) U3.15(DRDY)
I2C2_SDA: U1.30(PB11)
ICM42688_CS: R33.12(AP_CS) U1.10(PC2)
ICM42688_INT: R33.4(INT1/INT) U1.11(PC3)
IIC1_SCL: U1.58(PB6) U2.4(SCK)
IIC1_SDA: U1.59(PB7) U2.3(SDI)
IIC2_SCL: U1.29(PB10)
IIC3_SCL: U1.41(PA8) U3.1(SCL)
IIC3_SDA: U1.40(PC9) U3.16(SDA)
LED-GPIO16: LED3.2(A) U7.8(XDP_DCDC)
M1: R114.2
M2: R116.2
M3: R118.2
M4: R120.2
MISO-GPIO12: U7.10(MTDI) U8.16(MISO_TX)
MOSI-GPIO13: U7.12(MTCK) U8.17(MOSI_RX)
NRST: C393.2 R130.2 U1.7(NRST) U29.3(C) U29.4(D)
NSS-GPIO15: R5.2 U7.13(MTDO) U8.19(NSS_CTS)
OSC-IN: C8.2 U7.28(XTAL_IN) X2.1(OSC1)
OSC-OUT: C7.2 U7.27(XTAL_OUT) X2.3(OSC2)
Rst_GPIO2: U7.14(GPIO2) U8.3(NRESET)
RX-GPIO3: R8.1 U7.25(U0RXD)
RXEN-GPIO9: U7.18(SD_DATA_2) U10.6(RXEN)
SCK-GPIO14: U7.9(MTMS) U8.18(SCK_RTSN)
SPI1_MISO: R33.14(AP_SDA/AP_SDIO/AP_SDI) U1.22(PA6)
SPI1_MOSI: R33.1(AP_SDO/AP_AD0) U1.23(PA7)
SPI1_SCK: R33.13(AP_SCL/AP_SCLK) U1.21(PA5)
SPI2_CS: U1.33(PB12) U5.1(CS#)
SPI2_MISO: U1.35(PB14) U5.2(DO(IO1))
SPI2_MOSI: U1.36(PB15) U5.5(DI(IO0))
SPI2_SCK: U1.34(PB13) U5.6(CLK)
SPI3_CS: R133.2 U20.8(CS#)
SPI3_MISO: U1.56(PB4(NJTRST)) U20.9(SDIN)
SPI3_MOSI: U1.57(PB5) U20.11(SDOUT)
SPI3_SCK: U1.55(PB3(JTDOTRACESWO)) U20.10(SCLK)
SWCLK: U1.49(PA14(JTCK-SWCLK))
SWDIO: U1.46(PA13(JTMS-SWDIO))
T3_CH3: U1.39(PC8)
T3_CH4: U1.27(PB1)
T8_CH1: U1.37(PC6)
T8_CH2: U1.38(PC7)
TX-GPIO1: R7.1 U7.26(U0TXD)
TXEN-GPIO10: U7.19(SD_DATA_3) U10.5(TXEN)
UART4_RX: U1.15(PA1)
UART4_TX: U1.14(PA0-WKUP(PA0))
UART5_RX: U1.54(PD2)
UART5_TX: U1.53(PC12)
USART1_RX: U1.43(PA10)
USART1_TX: U1.42(PA9)
USART2_RX: U1.17(PA3)
USART2_TX: U1.16(PA2)
USART3_RX: U1.52(PC11)
USART3_TX: U1.51(PC10)
VIDEO_IN: C336.2 R138.1
VTX: R139.1
WAIT0: U1.61(PB8)
WAIT1: U1.62(PB9)
$1N1197: Q1.4(G) R114.1 R115.1
$1N1198: C318.1 Q1.5(D) Q1.6(D) Q1.7(D) Q1.8(D) Q1.9(D)
$1N1204: Q2.4(G) R116.1 R117.1
$1N1205: C319.1 Q2.5(D) Q2.6(D) Q2.7(D) Q2.8(D) Q2.9(D)
$1N1211: Q3.4(G) R118.1 R119.1
$1N1212: C320.1 Q3.5(D) Q3.6(D) Q3.7(D) Q3.8(D) Q3.9(D)
$1N1218: Q4.4(G) R120.1 R121.1
$1N1219: C321.1 Q4.5(D) Q4.6(D) Q4.7(D) Q4.8(D) Q4.9(D)
$1N2774: C370.1 U3.8(SETP)
$1N2779: C370.2 U3.12(SETC)
$1N2807: C371.1 U3.10(C1)
$1N4326: U1.5(PH0-OSC_IN(PH0)) X1.3
$1N4335: U1.6(PH1-OSC_OUT(PH1)) X1.1
$1N4576: LED4.2(A) R132.2
$1N6614: C338.2 U27.3(VAUX)
$1N6616: R128.1 U27.2(PG)
$1N6619: R129.1 U27.14(EN)
$1N6622: U27.9(L2) U28.1
$1N6623: U27.11(L1) U28.2
$1N8521: C373.1 U1.31(VCAP_1)
$1N8557: C374.1 U1.47(VCAP_2)
$1N10992: U20.6(XFB) X3.1(OSC1)
$1N10993: U20.5(CLKIN) X3.3(OSC2)
$1N11005: R134.2 U20.12(LOS)
$1N11009: C336.1 U20.22(VIN)
$1N11012: R135.1 U20.19(RESET#)
$1N11013: R137.1 U20.17(VSYNC#)
$1N11014: R136.1 U20.18(HSYNC#)
$1N11017: C314.2 C317.2 R139.2
$1N11018: C317.1 U20.26(VOUT)
$1N11019: C314.1 U20.25(SAG)
$1N13942: C344.2 U31.3(VAUX)
$1N13944: R140.1 U31.2(PG)
$1N13946: R141.1 U31.14(EN)
$1N13949: U30.1 U31.9(L2)
$1N13950: U30.2 U31.11(L1)
$1N13954: R142.1 R143.2 U31.5(FB)
$2N2021: C3.1 R1.1 U7.32(EXT_RSTB)
$2N2023: R43.1 U7.31(RES12K)
$2N2025: R42.2 U7.7(CHIP_EN)
$2N2028: U8.4(XTA) X4.3(OUT)
$2N2031: U8.6(XTB) X4.1(IN)
$2N2036: C2.2 U8.1(VR_PA)
$2N2038: J1.1 U10.10(ANT)
$2N2039: FL1.1(IN) U8.22(RFIO)
$2N2049: LED3.1(K) R6.1
$2N2054: H1.4 R8.2
$2N2055: H1.3 R7.2
$2N2065: FL1.3(OUT) U10.4(TXRX)

Not connected (* = marked no-connect by the designer): CN1 1 2; MP1 1; MP2 1; MP3 1; MP4 1; R33 2(RESV)* 3(RESV)* 9(INT2/FSYNC/CLKIN)* 10(RESV)*; U1 2(PC13) 3(PC14-OSC32_IN(PC14))* 4(PC15-OSC32_OUT(PC15))* 8(PC0) 9(PC1) 20(PA4) 25(PC5) 26(PB0) 28(PB2-BOOT1(PB2)) 50(PA15(JTDI)); U3 3(NC)* 5(NC)* 6(NC)* 7(NC)* 14(NC)*; U7 5(VDD_RTC) 6(TOUT) 20(SD_CMD) 21(SD_CLK) 22(SD_DATA_0) 23(SD_DATA_1); U8 9(DIO2)* 10(DIO3)* 14(DCC_SW)*; U10 13(DNC)* 14(VDD)*; U20 1(NC)* 2(NC)* 7(CLKOUT)* 13(NC)* 14(NC)* 15(NC)* 16(NC)* 27(NC)* 28(NC)*

## Notes on the sheets
sheet 2
- 射频模块2.4G
- 时钟信号
- 状态指示灯

# Board PCB3
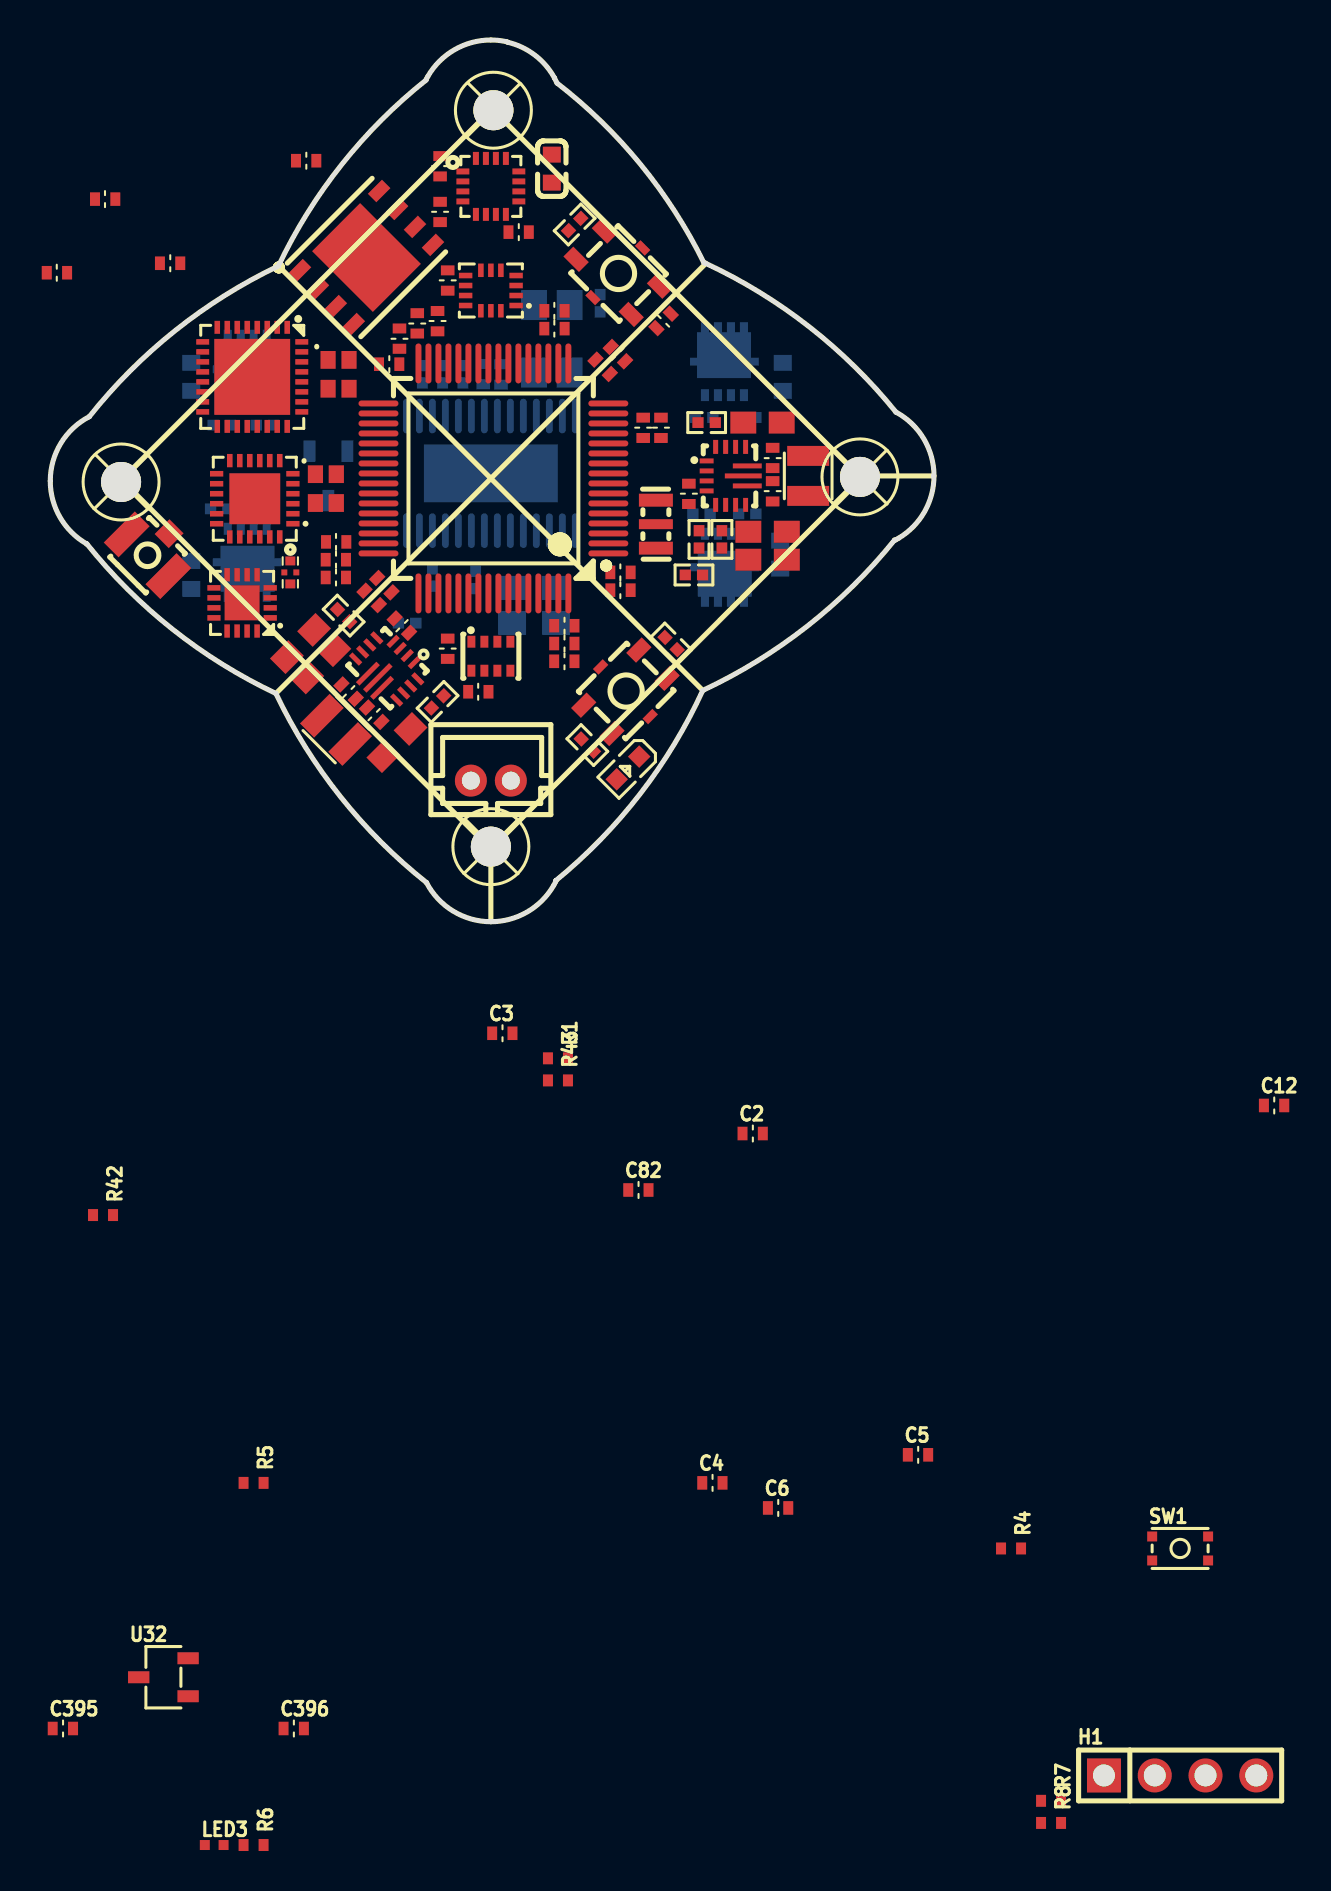
[diagram p2: board, top side]
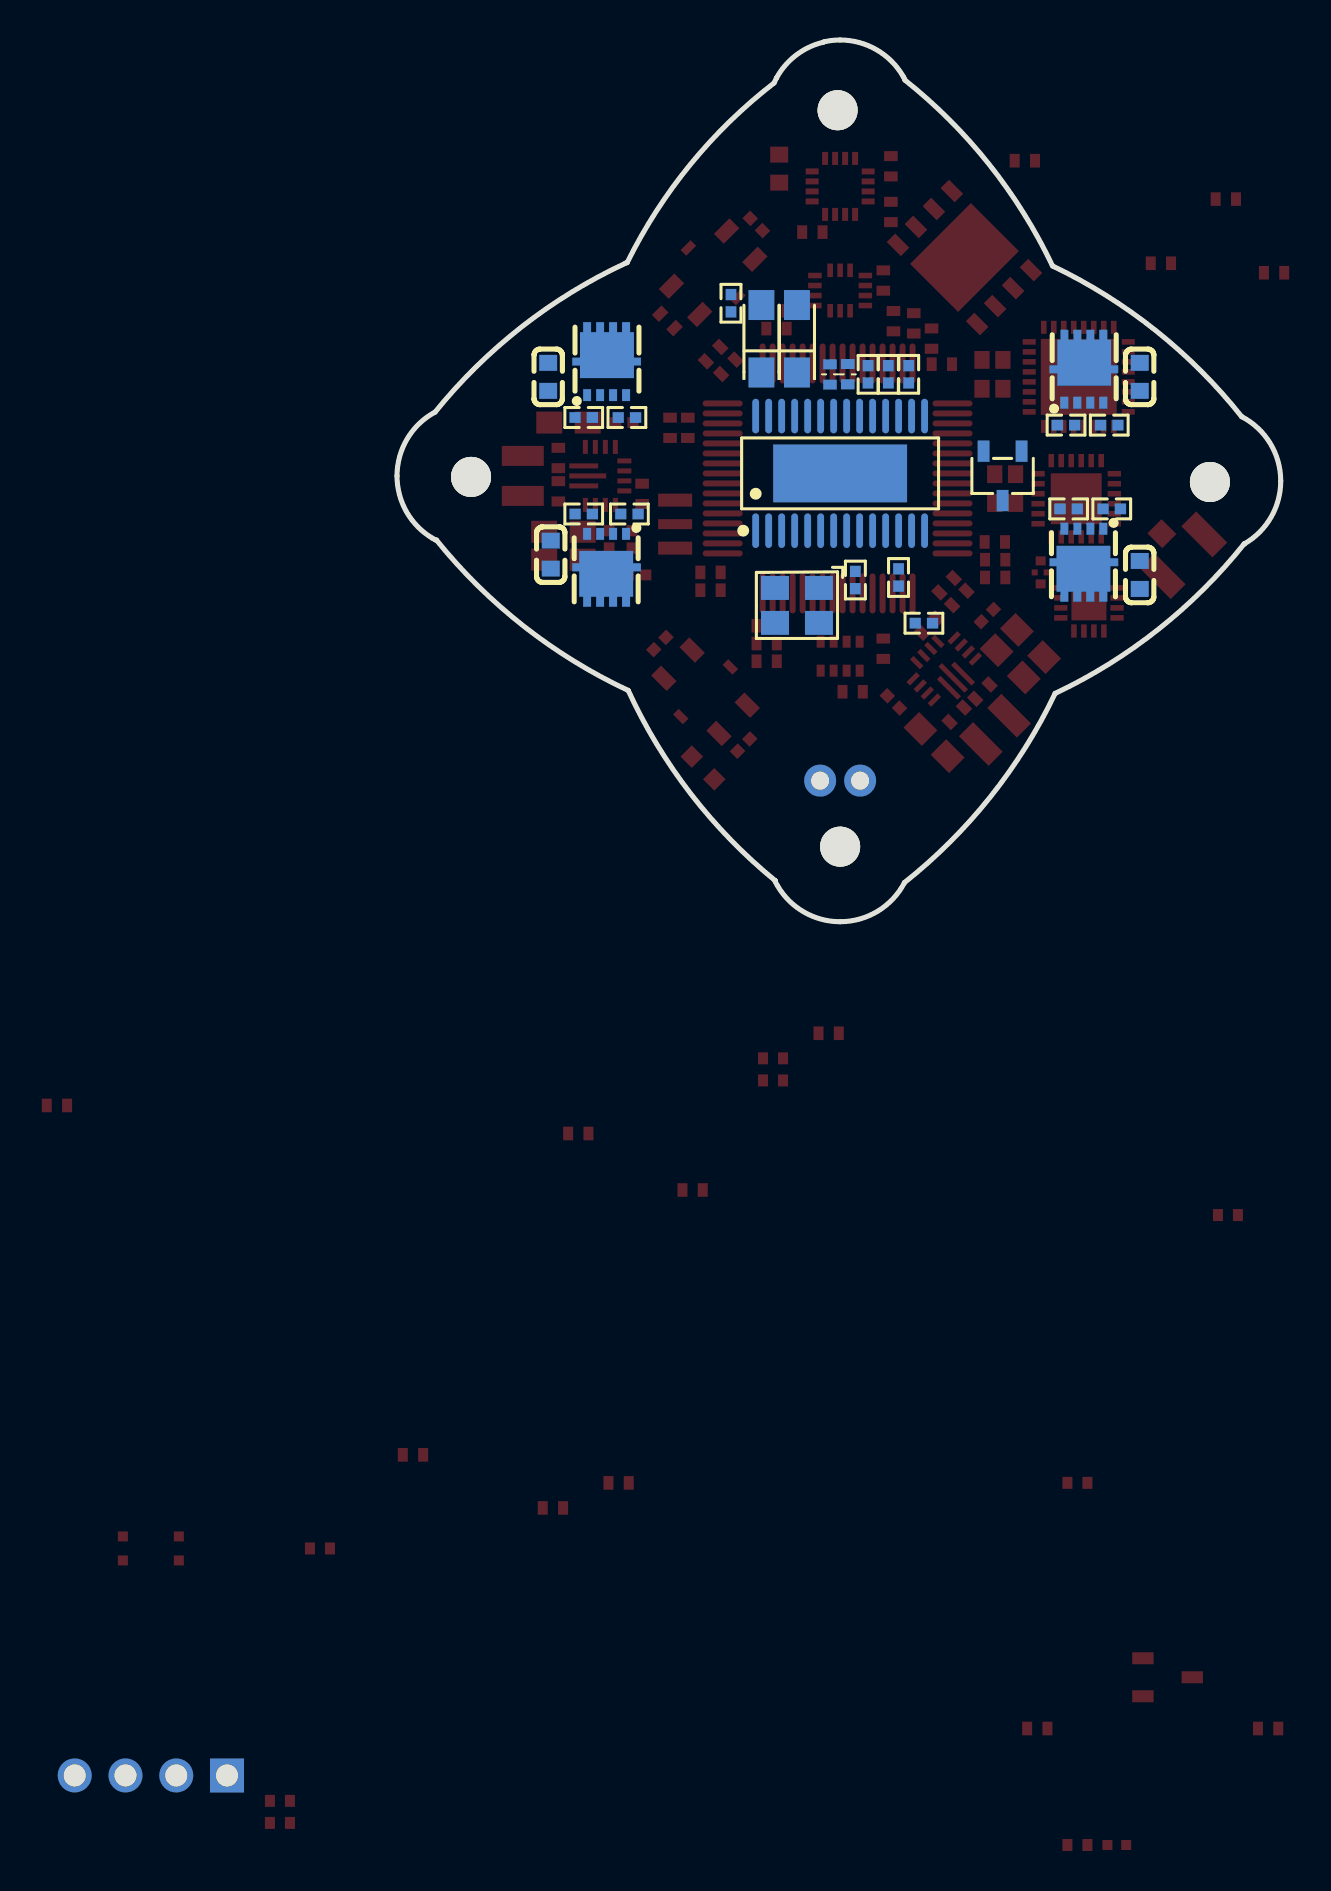
[diagram p3: board, bottom side, seen from below]

Outline 44.21 x 44.1 mm; copper layers: Top Layer, Bottom Layer. Coordinates in mm from the lower left corner of the outline.
Outline path: 0,22.04 arc(0.53,23.92) 1.95,25.26 arc(1.95,25.26) 1.95,25.26 arc(6.25,29.56) 11.4,32.79 arc(11.41,32.8) 11.42,32.81 arc(14.58,37.87) 18.8,42.09 arc(18.81,42.12) 18.82,42.14 arc(18.85,42.21) 18.89,42.27 arc(20.22,43.61) 22.04,44.1 arc(22.44,44.07) 22.83,44.01 arc(22.86,44) 22.88,43.98 arc(24.24,43.34) 25.22,42.2 arc(25.23,42.19) 25.23,42.19 arc(25.29,42.07) 25.35,41.94 arc(29.53,37.87) 32.7,32.96 arc(32.7,32.96) 32.71,32.96 arc(32.76,32.95) 32.81,32.92 arc(37.98,29.74) 42.3,25.49 arc(42.31,25.49) 42.31,25.48 arc(43.7,24.15) 44.21,22.3 arc(43.74,20.51) 42.45,19.19 arc(42.37,19.14) 42.3,19.1 arc(42.27,19.09) 42.24,19.08 arc(42.24,19.08) 42.23,19.08 arc(37.87,14.78) 32.66,11.57 arc(32.65,11.56) 32.64,11.56 arc(29.51,6.39) 25.3,2.06 25.3,2.06 arc(25.3,2.06) 25.3,2.06 arc(25.3,2.03) 25.29,2 arc(25.24,1.91) 25.19,1.82 arc(23.86,0.49) 22.04,0 arc(20.16,0.53) 18.82,1.95 arc(18.82,1.96) 18.82,1.96 arc(14.52,6.25) 11.3,11.4 arc(11.28,11.41) 11.27,11.42 arc(6.13,14.62) 1.84,18.89 arc(1.83,18.89) 1.82,18.9 arc(1.82,18.9) 1.81,18.9 arc(0.49,20.23) 0,22.04
Stack: Top Layer 0.035mm / Dielectric1 1.51mm FR4 er 4.5 / Bottom Layer 0.035mm

## Design rules (mm)
template: JLCPCB Capability(Two Layers Board)
spacing copperThickness1oz (default): track to track 0.102, other pairs 0.152 to 0.3
spacing copperThickness2oz: track to track 0.203, other pairs 0.152 to 0.3
track width copperThickness1oz (default): min 0.127, default 0.254, max 2.54
track width copperThickness2oz: min 0.203, default 0.254, max 2.54
differential pair differentialPair (default): width min 0.127, default 0.254, max 2.54; gap min 0.152, default 0.152
via viaSize (default): diameter min 0.5, default 0.61, max 10; hole min 0.3, default 0.305, max 6.3

## Placement (name value [footprint] x y rotation side)
C2  10nF  [C0402]  35.15 -10.59 0 top
C3  100nF  [C0402]  22.62 -5.58 0 top
C4  100nF  [C0402]  33.13 -28.06 0 top
C5  100nF  [C0402]  43.42 -26.66 0 top
C6  470nF  [C0402]  36.42 -29.32 0 top
C7  10pF  [C0402]  12.81 38.06 0 top
C8  10pF  [C0402]  6 32.93 0 top
C12  100nF  [C0402]  61.23 -9.19 0 top
C82  10nF  [C0402]  29.43 -13.42 0 top
C314  47uF  [CAP-SMD_L3.2-W1.6-RD]  24.2 29.15 90 bottom
C317  47uF  [CAP-SMD_L3.2-W1.6-RD]  25.98 29.15 90 bottom
C318  4.7uF  [C0603]  36.52 18.36 90 bottom
C319  4.7uF  [C0603]  7.06 17.34 270 bottom
C320  4.7uF  [C0603]  7.06 27.25 270 bottom
C321  4.7uF  [C0603]  36.65 27.25 270 bottom
C322  1uF  [C0402]  0.33 32.46 180 top
C323  1uF  [C0402]  2.74 36.14 180 top
C336  100nF  [C0402]  22.55 27.38 90 bottom
C338  100nF  [C0402]  17.6 14.8 315 top
C340  10uF  [C0402]  16.2 10.36 135 top
C344  100nF  [C0402]  31.95 21.41 90 top
C346  10uF  [C0402]  36.14 23.18 270 top
C350  10uF  [C0402]  14.93 11.5 315 top
C351  10uF  [C0402]  36.14 21.53 90 top
C352  22uF  [C0805]  35.63 24.96 180 top
C353  22uF  [C0805]  17.34 8.96 45 top
C354  22uF  [C0805]  35.89 19.5 180 top
C355  47uF  [C0805]  35.89 18.1 180 top
C357  22uF  [C0805]  13.53 12.9 45 top
C358  47uF  [C0805]  12.52 13.91 45 top
C365  100nF  [C0402]  21.41 11.5 180 top
C366  100nF  [C0402]  19.88 13.66 90 top
C368  100nF  [C0402]  19.88 32.07 90 top
C369  100nF  [C0402]  19.5 35.5 90 top
C370  220nF  [C0402]  23.44 34.49 0 top
C371  4.7uF  [C0603]  25.09 37.66 90 top
C372  100nF  [C0402]  19.5 37.79 90 top
C373  22uF  [C0402]  19.37 30.04 90 top
C374  22uF  [C0402]  14.3 18.99 180 top
C375  100nF  [C0402]  28.52 17.47 180 top
C376  100nF  [C0402]  18.36 29.92 270 top
C377  100nF  [C0402]  14.3 17.22 0 top
C378  100nF  [C0402]  28.52 16.58 180 top
C379  100nF  [C0402]  17.47 29.15 270 top
C380  100nF  [C0402]  14.3 18.1 0 top
C381  100nF  [C0402]  25.73 14.8 0 top
C382  100nF  [C0402]  25.22 30.55 180 top
C383  100nF  [C0402]  28.39 28.39 135 top
C384  100nF  [C0402]  25.73 13.91 0 top
C385  100nF  [C0402]  25.22 29.66 180 top
C386  100nF  [C0402]  16.71 16.83 135 top
C387  100nF  [C0402]  16.96 27.88 0 top
C388  100nF  [C0402]  25.73 13.02 0 top
C389  100nF  [C0402]  27.63 27.76 135 top
C390  4.7uF  [C0402]  16.07 16.2 135 top
C391  1uF  [C0402]  29.66 24.71 90 top
C392  100nF  [C0402]  30.55 24.71 90 top
C393  100nF  [C0402]  30.68 30.04 225 top
C394  100nF  [C0402]  21.66 27.38 270 bottom
C395  1uF  [C0402]  0.64 -40.35 0 top
C396  1uF  [C0402]  12.19 -40.35 0 top
CN1  B2B-PH-K-S(LF)(SN)  [CONN-TH_B2B-PH-K-S]  22.04 7.06 0 top
FL1  2450FM07D0034T  [FILTER-SMD_4P-L1.0-W0.5-L]  12.01 17.47 270 top
H1  PZ254V-11-04P  [HDR-TH_4P-P2.54-V-M]  56.52 -42.7 0 top
J1  BWU.FL-IPEX1  [IPEX-SMD_BWIPX-1-001E]  5.4 18.87 225 top
LED3  XL-1005UGC  [0402]  8.2 -46.17 0 top
LED4  NCD0603B1  [LED0603-RD]  28.9 7.69 225 top
MP1  -  [M2螺丝]  22.04 3.75 0 top
MP2  -  [M2螺丝]  22.17 40.58 0 top
MP3  -  [M2螺丝]  3.54 21.99 0 top
MP4  -  [M2螺丝]  40.51 22.25 0 top
Q1  TPN2R703NL,L1Q(M  [TSON-8_L3.1-W3.1-P0.65-LS3.3-BL-EP]  33.73 17.72 0 bottom
Q2  TPN2R703NL,L1Q(M  [TSON-8_L3.1-W3.1-P0.65-LS3.3-BL-EP]  9.85 17.98 0 bottom
Q3  TPN2R703NL,L1Q(M  [TSON-8_L3.1-W3.1-P0.65-LS3.3-BL-EP]  9.85 27.63 180 bottom
Q4  TPN2R703NL,L1Q(M  [TSON-8_L3.1-W3.1-P0.65-LS3.3-BL-EP]  33.73 28.01 180 bottom
R1  12kΩ  [0402#2]  25.4 -6.83 0 top
R4  12kΩ  [0402#2]  48.07 -31.34 0 top
R5  12kΩ  [0402#2]  10.17 -28.06 0 top
R6  12kΩ  [0402#2]  10.17 -46.17 0 top
R7  100Ω  [0402#2]  50.07 -43.97 0 top
R8  100Ω  [0402#2]  50.07 -45.07 0 top
R33  ICM-42688-P  [LGA-14_L3.0-W2.5-P0.50-TL]  22.04 31.57 180 top
R42  12kΩ  [0402#2]  2.64 -14.67 0 top
R43  12kΩ  [0402#2]  25.4 -7.94 0 top
R114  330R  [R0402]  32.58 20.39 180 bottom
R115  10K  [R0402]  34.87 20.39 0 bottom
R116  330R  [R0402]  10.61 20.64 0 bottom
R117  10K  [R0402]  8.45 20.64 180 bottom
R118  330R  [R0402]  10.74 24.84 0 bottom
R119  10K  [R0402]  8.58 24.84 180 bottom
R120  330R  [R0402]  32.71 25.22 180 bottom
R121  10K  [R0402]  34.87 25.22 0 bottom
R128  100K  [R0402]  14.68 15.31 135 top
R129  10K  [R0402]  19.37 10.99 225 top
R130  10K  [R0402]  26.23 34.87 225 top
R131  10K  [R0402]  31.06 13.91 315 top
R132  330R  [R0402]  26.87 8.83 315 top
R133  10K  [R0402]  21.28 17.09 90 bottom
R134  1K  [R0402]  19.12 17.22 90 bottom
R135  10K  [R0402]  20.64 27.38 90 bottom
R136  1K  [R0402]  19.63 27.38 90 bottom
R137  1K  [R0402]  18.61 27.38 90 bottom
R138  75R  [R0402]  17.85 14.93 180 bottom
R139  75R  [R0402]  27.5 30.93 270 bottom
R140  100K  [R0402]  32.2 17.34 0 top
R141  10K  [R0402]  32.84 24.96 0 top
R142  39K  [R0402]  33.6 19.12 90 top
R143  402K  [R0402]  32.46 19.12 90 top
SW1  TS-1928-B  [KEY-SMD_4P-L2.8-W2.0-P1.20-LS3.0-TL]  56.52 -31.34 0 top
U1  STM32F405RGT6  [LQFP-64_L10.0-W10.0-P0.50-LS12.0-BL]  22.17 22.17 90 top
U2  BMP280  [LGA-8_L2.5-W2.0-P0.65_AMP6127]  22.04 13.28 90 top
U3  HMC5883L  [LPCC-16_L3.0-W3.0-P0.50-BL]  22.04 36.77 270 top
U5  W25Q128JVPIQ  [WSON-8_L5.0-W6.0-P1.27-BL-EP]  15.82 33.22 315 top
U7  ESP8285H16  [QFN-32_L5.0-W5.0-P0.50-TL-EP3.7]  10.1 27.25 270 top
U8  SX1280IMLTRT  [QFN-24_L4.0-W4.0-P0.50-BL-EP2.6]  10.23 21.15 90 top
U10  AT2401C  [QFN-16_L3.0-W3.0-P0.50-BL-EP1.7]  9.6 15.95 90 top
U13  TS3315A 160gf 025  [SW-SMD_4P-L3.4-W3.4-P2.00-LS4.0_TS3315A160GF]  28.77 11.5 45 top
U20  AT7456E  [TSSOP-28_L9.7-W4.4-P0.65-LS6.4-BL-EP-2]  22.04 22.42 180 bottom
U26  ME6211A33M3G-N  [SOT-23-3_L2.9-W1.6-P1.90-LS2.8-BR]  13.91 22.3 90 bottom
U27  TPS630701RNMR  [VQFN-HR-15_L3.0-W2.5-P0.50-BL_TPS63070RNMR]  16.96 12.77 135 top
U28  1.5uH  [IND-SMD_L2.5-W2.0_MEKK2520TR47M]  14.3 9.6 135 top
U29  TS3315A 160gf 025  [SW-SMD_4P-L3.4-W3.4-P2.00-LS4.0_TS3315A160GF]  28.39 32.46 315 top
U30  1.5uH  [IND-SMD_L2.5-W2.0_MEKK2520TR47M]  37.92 22.3 270 top
U31  TPS630701RNMR  [VQFN-HR-15_L3.0-W2.5-P0.50-BL_TPS63070RNMR]  33.85 22.3 270 top
U32  ME6211A33M3G-N  [SOT-23-3_L2.9-W1.6-P1.90-LS2.8-BR]  5.66 -37.78 0 top
X1  8MHz  [OSC-SMD_3P-L3.2-W1.3-P1.2-L]  30.3 19.88 270 top
X2  26MHz  [CRYSTAL-SMD_4P-L2.0-W1.6-BL]  14.42 27.38 270 top
X3  27MHz  [OSC-SMD_4P-L3.2-W2.5-BL]  24.2 15.82 0 bottom
X4  52MHz  [CRYSTAL-SMD_4P-L2.0-W1.6-BL]  13.79 21.66 270 top

## Footprints (pads in the part's own frame, mm; a bottom-side part is the same pattern mirrored in y, then rotated)
0402
  rect 0.5x0.5 smd: 1(-0.47,0) 2(0.47,0)
0402#2
  rect 0.5x0.6 smd: 1(-0.5,0) 2(0.5,0)
C0402
  rect 0.5x0.68 smd: 1(-0.516,0) 2(0.5,0)
C0603
  rect 0.8x0.9 smd: 1(-0.7,0) 2(0.7,0)
C0805
  rect 1.3x1.1 smd: 1(-0.962,0) 2(0.962,0)
CAP-SMD_L3.2-W1.6-RD
  rect 1.5x1.296 smd: 1(-1.687,0) 2(1.687,0)
CONN-TH_B2B-PH-K-S
  round 1.6 hole 0.9: 1(1,0) 2(-1,0)
CRYSTAL-SMD_4P-L2.0-W1.6-BL
  rect 0.889x0.762 smd: 1(-0.722,-0.523) 2(0.722,-0.523) 3(0.722,0.523) 4(-0.722,0.523)
FILTER-SMD_4P-L1.0-W0.5-L
  rect 0.45x0.5 smd: 1(-0.575,0) 3(0.575,0)
  rect 0.3x0.3 smd: 2(0,-0.3) 4(0,0.3)
HDR-TH_4P-P2.54-V-M
  rect 1.7x1.7 hole 1.1: 1(-3.81,0)
  round 1.7 hole 1.1: 2(-1.27,0) 3(1.27,0) 4(3.81,0)
IND-SMD_L2.5-W2.0_MEKK2520TR47M
  rect 1x2.1 smd: 1(1,0) 2(-1,0)
IPEX-SMD_BWIPX-1-001E
  rect 1.05x1 smd: 1(-0.762,0)
  rect 2.2x1.05 smd: 2(0.762,-1.475) 3(0.762,1.475)
KEY-SMD_4P-L2.8-W2.0-P1.20-LS3.0-TL
  rect 0.5x0.5 smd: 1(-1.4,0.6) 2(1.4,0.6) 3(-1.4,-0.6) 4(1.4,-0.6)
LED0603-RD
  rect 0.8x0.8 smd: 1(-0.799,-0.004) 2(0.799,0.004)
LGA-8_L2.5-W2.0-P0.65_AMP6127
  rect 0.6x0.4 smd: 1(0.725,0.975) 2(0.725,0.325) 3(0.725,-0.325) 4(0.725,-0.975) 5(-0.725,-0.975) 6(-0.725,-0.325) 7(-0.725,0.325) 8(-0.725,0.975)
LGA-14_L3.0-W2.5-P0.50-TL
  rect 0.675x0.28 smd: 1(-1.262,0.75) 2(-1.262,0.25) 3(-1.262,-0.25) 4(-1.262,-0.75) 8(1.262,-0.75) 9(1.262,-0.25) 10(1.262,0.25) 11(1.262,0.75)
  rect 0.28x0.675 smd: 5(-0.5,-1.012) 6(0,-1.012) 7(0.5,-1.012) 12(0.5,1.012) 13(0,1.012) 14(-0.5,1.012)
LPCC-16_L3.0-W3.0-P0.50-BL
  rect 0.3x0.65 smd: 1(-0.749,-1.4) 2(-0.248,-1.4) 3(0.252,-1.4) 4(0.751,-1.4) 9(0.75,1.4) 10(0.25,1.4) 11(-0.25,1.4) 12(-0.75,1.4)
  rect 0.65x0.3 smd: 5(1.4,-0.748) 6(1.4,-0.248) 7(1.4,0.252) 8(1.4,0.752) 13(-1.4,0.752) 14(-1.4,0.252) 15(-1.4,-0.248) 16(-1.4,-0.748)
LQFP-64_L10.0-W10.0-P0.50-LS12.0-BL
  oval 0.3x2 smd: 1(-3.75,-5.75) 2(-3.25,-5.75) 3(-2.75,-5.75) 4(-2.25,-5.75) 5(-1.75,-5.75) 6(-1.25,-5.75) 7(-0.75,-5.75) 8(-0.25,-5.75) 9(0.25,-5.75) 10(0.75,-5.75) 11(1.25,-5.75) 12(1.75,-5.75) 13(2.25,-5.75) 14(2.75,-5.75) 15(3.25,-5.75) 16(3.75,-5.75) 33(3.75,5.75) 34(3.25,5.75) 35(2.75,5.75) 36(2.25,5.75) 37(1.75,5.75) 38(1.25,5.75) 39(0.75,5.75) 40(0.25,5.75) 41(-0.25,5.75) 42(-0.75,5.75) 43(-1.25,5.75) 44(-1.75,5.75) 45(-2.25,5.75) 46(-2.75,5.75) 47(-3.25,5.75) 48(-3.75,5.75)
  oval 2x0.3 smd: 17(5.75,-3.75) 18(5.75,-3.25) 19(5.75,-2.75) 20(5.75,-2.25) 21(5.75,-1.75) 22(5.75,-1.25) 23(5.75,-0.75) 24(5.75,-0.25) 25(5.75,0.25) 26(5.75,0.75) 27(5.75,1.25) 28(5.75,1.75) 29(5.75,2.25) 30(5.75,2.75) 31(5.75,3.25) 32(5.75,3.75) 49(-5.75,3.75) 50(-5.75,3.25) 51(-5.75,2.75) 52(-5.75,2.25) 53(-5.75,1.75) 54(-5.75,1.25) 55(-5.75,0.75) 56(-5.75,0.25) 57(-5.75,-0.25) 58(-5.75,-0.75) 59(-5.75,-1.25) 60(-5.75,-1.75) 61(-5.75,-2.25) 62(-5.75,-2.75) 63(-5.75,-3.25) 64(-5.75,-3.75)
M2螺丝
  round 2 hole 2: 1(0,0)
OSC-SMD_3P-L3.2-W1.3-P1.2-L
  rect 0.65x1.7 smd: 1(-1.2,0) 3(1.2,0)
  rect 0.5x1.7 smd: 2(0,0)
OSC-SMD_4P-L3.2-W2.5-BL
  rect 1.4x1.2 smd: 1(-1.1,-0.875) 2(1.1,-0.875) 3(1.1,0.875) 4(-1.1,0.875)
QFN-16_L3.0-W3.0-P0.50-BL-EP1.7
  rect 0.28x0.665 smd: 1(-0.75,-1.407) 2(-0.25,-1.407) 3(0.25,-1.407) 4(0.75,-1.407) 9(0.75,1.407) 10(0.25,1.407) 11(-0.25,1.407) 12(-0.75,1.407)
  rect 0.665x0.28 smd: 5(1.407,-0.75) 6(1.407,-0.25) 7(1.407,0.25) 8(1.407,0.75) 13(-1.407,0.75) 14(-1.407,0.25) 15(-1.407,-0.25) 16(-1.407,-0.75)
  rect 1.75x1.75 smd: 17(0,0)
QFN-24_L4.0-W4.0-P0.50-BL-EP2.6
  rect 0.28x0.665 smd: 1(-1.25,-1.907) 2(-0.75,-1.907) 3(-0.25,-1.907) 4(0.25,-1.907) 5(0.75,-1.907) 6(1.25,-1.907) 13(1.25,1.907) 14(0.75,1.907) 15(0.25,1.907) 16(-0.25,1.907) 17(-0.75,1.907) 18(-1.25,1.907)
  rect 0.665x0.28 smd: 7(1.907,-1.25) 8(1.907,-0.75) 9(1.907,-0.25) 10(1.907,0.25) 11(1.907,0.75) 12(1.907,1.25) 19(-1.907,1.25) 20(-1.907,0.75) 21(-1.907,0.25) 22(-1.907,-0.25) 23(-1.907,-0.75) 24(-1.907,-1.25)
  rect 2.55x2.55 smd: 25(0,0)
QFN-32_L5.0-W5.0-P0.50-TL-EP3.7
  rect 0.65x0.28 smd: 1(-2.478,1.75) 2(-2.478,1.25) 3(-2.478,0.75) 4(-2.478,0.25) 5(-2.478,-0.25) 6(-2.478,-0.75) 7(-2.478,-1.25) 8(-2.478,-1.75) 17(2.478,-1.75) 18(2.478,-1.25) 19(2.478,-0.75) 20(2.478,-0.25) 21(2.478,0.25) 22(2.478,0.75) 23(2.478,1.25) 24(2.478,1.75)
  rect 0.28x0.65 smd: 9(-1.75,-2.478) 10(-1.25,-2.478) 11(-0.75,-2.478) 12(-0.25,-2.478) 13(0.25,-2.478) 14(0.75,-2.478) 15(1.25,-2.478) 16(1.75,-2.478) 25(1.75,2.478) 26(1.25,2.478) 27(0.75,2.478) 28(0.25,2.478) 29(-0.25,2.478) 30(-0.75,2.478) 31(-1.25,2.478) 32(-1.75,2.478)
  rect 3.8x3.8 smd: 33(0,0)
R0402
  rect 0.566x0.54 smd: 1(-0.433,0) 2(0.433,0)
SOT-23-3_L2.9-W1.6-P1.90-LS2.8-BR
  rect 1.07x0.6 smd: 1(1.235,-0.95) 2(1.235,0.95) 3(-1.235,0)
SW-SMD_4P-L3.4-W3.4-P2.00-LS4.0_TS3315A160GF
  rect 1.1x0.7 smd: 1(-1.95,1) 2(1.95,1) 3(-1.95,-1) 4(1.95,-1)
  rect 0.7x0.4 smd: 5(0,1.755) 5(0,-1.755)
TSON-8_L3.1-W3.1-P0.65-LS3.3-BL-EP
  rect 0.4x0.6 smd: 1(-0.975,-1.675) 2(-0.325,-1.675) 3(0.325,-1.675) 4(0.975,-1.675) 5(0.975,1.675) 6(0.325,1.675) 7(-0.325,1.675) 8(-0.975,1.675)
  rect 0.6x0.4 smd: 9(-1.42,0) 9(1.42,0)
  rect 2.7x2.3 smd: 9(0.02,0.325)
TSSOP-28_L9.7-W4.4-P0.65-LS6.4-BL-EP-2
  oval 0.343x1.732 smd: 1(-4.225,-2.866) 2(-3.575,-2.866) 3(-2.925,-2.866) 4(-2.275,-2.866) 5(-1.625,-2.866) 6(-0.975,-2.866) 7(-0.325,-2.866) 8(0.325,-2.866) 9(0.975,-2.866) 10(1.625,-2.866) 11(2.275,-2.866) 12(2.925,-2.866) 13(3.575,-2.866) 14(4.225,-2.866) 15(4.225,2.866) 16(3.575,2.866) 17(2.925,2.866) 18(2.275,2.866) 19(1.625,2.866) 20(0.975,2.866) 21(0.325,2.866) 22(-0.325,2.866) 23(-0.975,2.866) 24(-1.625,2.866) 25(-2.275,2.866) 26(-2.925,2.866) 27(-3.575,2.866) 28(-4.225,2.866)
  rect 6.7x2.9 smd: 29(0,0)
VQFN-HR-15_L3.0-W2.5-P0.50-BL_TPS63070RNMR
  rect 0.25x0.7 smd: 1(-0.75,-1.016) 2(-0.25,-1.016) 3(0.25,-1.016) 4(0.75,-1.016)
  rect 0.7x0.25 smd: 5(1.45,-0.566) 6(1.45,-0.066) 7(1.45,0.434) 8(1.45,0.934) 12(-1.45,0.934) 13(-1.45,0.434) 14(-1.45,-0.066) 15(-1.45,-0.566)
  rect 0.25x1.45 smd: 9(0.5,1.016) 11(-0.5,1.016)
  rect 0.25x1.85 smd: 10(0,0.817)
WSON-8_L5.0-W6.0-P1.27-BL-EP
  rect 0.6x1 smd: 1(-1.905,-2.8) 2(-0.635,-2.8) 3(0.635,-2.8) 4(1.905,-2.8) 5(1.905,2.8) 6(0.635,2.8) 7(-0.635,2.8) 8(-1.905,2.8)
  rect 4.3x3.4 smd: 9(0,0)

## Nets
As in the schematic, except:
RST_GPIO2: U7.14 U8.3

Pads without a net: CN1 1 2; MP1 1; MP2 1; MP3 1; MP4 1; R33 2 3 9 10; U1 2 3 4 8 9 20 25 26 28 50; U3 3 5 6 7 14; U7 5 6 20 21 22 23; U8 9 10 14; U10 13 14; U20 1 2 7 13 14 15 16 27 28
